# EAGLE design v0.1 (EAGLE 8.4.3)
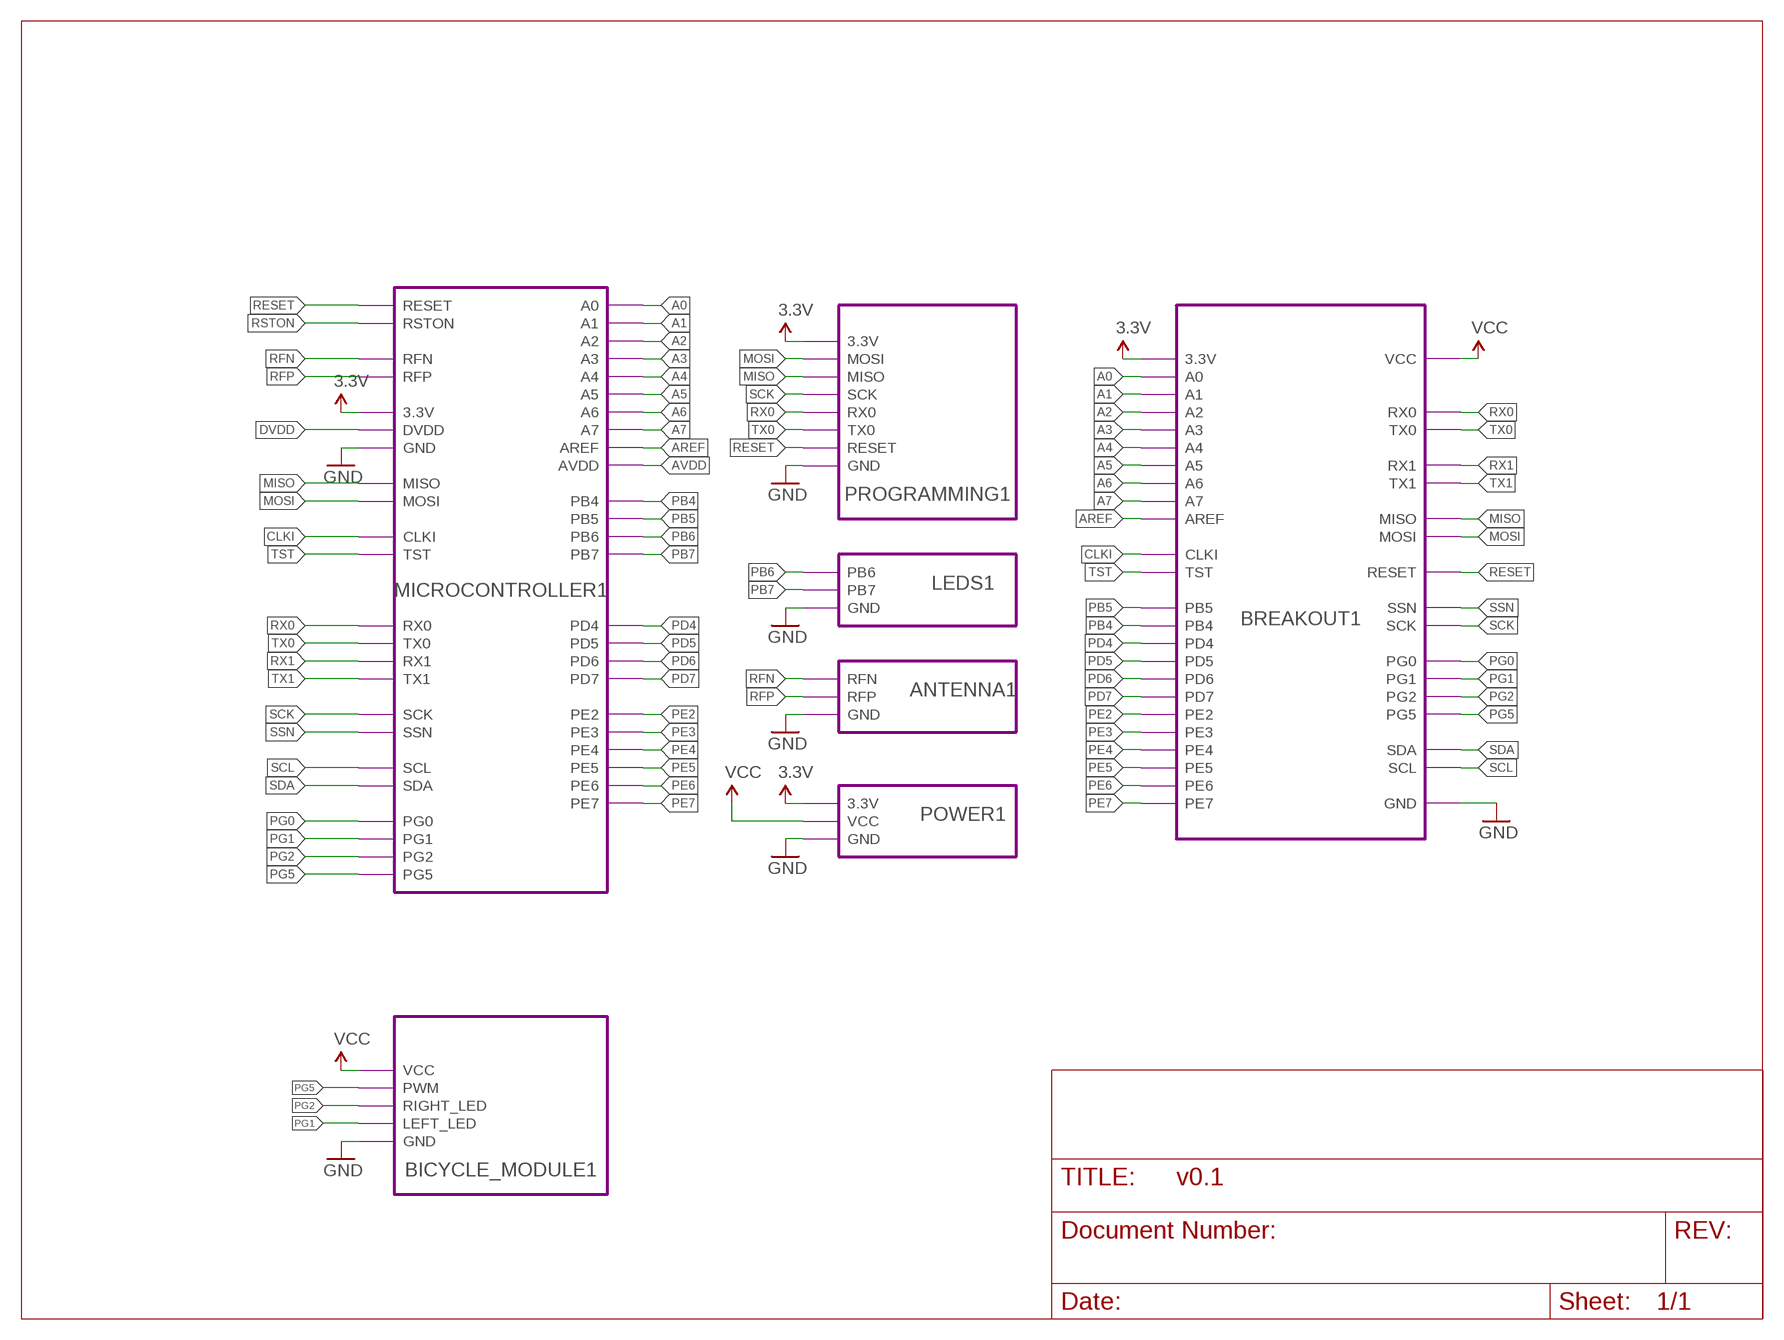
[diagram p0: schematic, sheet 1]

## Module instances
MICROCONTROLLER1 = MICROCONTROLLER
LEDS1 = LEDS
BREAKOUT1 = BREAKOUTS
ANTENNA1 = ANTENNA
POWER1 = POWER
PROGRAMMING1 = PROGRAMMING
BICYCLE_MODULE1 = BICYCLE_MODULE

## Nets
3.3V: port MICROCONTROLLER1.3.3V PROGRAMMING1.3.3V POWER1.3.3V BREAKOUT1.3.3V
A0: port MICROCONTROLLER1.A0 BREAKOUT1.A0
A1: port MICROCONTROLLER1.A1 BREAKOUT1.A1
A2: port MICROCONTROLLER1.A2 BREAKOUT1.A2
A3: port MICROCONTROLLER1.A3 BREAKOUT1.A3
A4: port MICROCONTROLLER1.A4 BREAKOUT1.A4
A5: port MICROCONTROLLER1.A5 BREAKOUT1.A5
A6: port MICROCONTROLLER1.A6 BREAKOUT1.A6
A7: port MICROCONTROLLER1.A7 BREAKOUT1.A7
AREF: port MICROCONTROLLER1.AREF BREAKOUT1.AREF
AVDD: port MICROCONTROLLER1.AVDD
CLKI: port MICROCONTROLLER1.CLKI BREAKOUT1.CLKI
DVDD: port MICROCONTROLLER1.DVDD
GND: port PROGRAMMING1.GND LEDS1.GND ANTENNA1.GND POWER1.GND MICROCONTROLLER1.GND BREAKOUT1.GND BICYCLE_MODULE1.GND
MISO: port PROGRAMMING1.MISO MICROCONTROLLER1.MISO BREAKOUT1.MISO
MOSI: port MICROCONTROLLER1.MOSI PROGRAMMING1.MOSI BREAKOUT1.MOSI
PB4: port MICROCONTROLLER1.PB4 BREAKOUT1.PB4
PB5: port MICROCONTROLLER1.PB5 BREAKOUT1.PB5
PB6: port MICROCONTROLLER1.PB6 LEDS1.PB6
PB7: port MICROCONTROLLER1.PB7 LEDS1.PB7
PD4: port MICROCONTROLLER1.PD4 BREAKOUT1.PD4
PD5: port MICROCONTROLLER1.PD5 BREAKOUT1.PD5
PD6: port MICROCONTROLLER1.PD6 BREAKOUT1.PD6
PD7: port MICROCONTROLLER1.PD7 BREAKOUT1.PD7
PE2: port MICROCONTROLLER1.PE2 BREAKOUT1.PE2
PE3: port MICROCONTROLLER1.PE3 BREAKOUT1.PE3
PE4: port MICROCONTROLLER1.PE4 BREAKOUT1.PE4
PE5: port MICROCONTROLLER1.PE5 BREAKOUT1.PE5
PE6: port MICROCONTROLLER1.PE6 BREAKOUT1.PE6
PE7: port MICROCONTROLLER1.PE7 BREAKOUT1.PE7
PG0: port MICROCONTROLLER1.PG0 BREAKOUT1.PG0
PG1: port MICROCONTROLLER1.PG1 BREAKOUT1.PG1 BICYCLE_MODULE1.LEFT_LED
PG2: port MICROCONTROLLER1.PG2 BREAKOUT1.PG2 BICYCLE_MODULE1.RIGHT_LED
PG5: port MICROCONTROLLER1.PG5 BREAKOUT1.PG5 BICYCLE_MODULE1.PWM
RESET: port MICROCONTROLLER1.RESET PROGRAMMING1.RESET BREAKOUT1.RESET
RFN: port MICROCONTROLLER1.RFN ANTENNA1.RFN
RFP: port MICROCONTROLLER1.RFP ANTENNA1.RFP
RSTON: port MICROCONTROLLER1.RSTON
RX0: port MICROCONTROLLER1.RX0 PROGRAMMING1.RX0 BREAKOUT1.RX0
RX1: port MICROCONTROLLER1.RX1 BREAKOUT1.RX1
SCK: port MICROCONTROLLER1.SCK PROGRAMMING1.SCK BREAKOUT1.SCK
SCL: port MICROCONTROLLER1.SCL BREAKOUT1.SCL
SDA: port MICROCONTROLLER1.SDA BREAKOUT1.SDA
SSN: port MICROCONTROLLER1.SSN BREAKOUT1.SSN
TST: port MICROCONTROLLER1.TST BREAKOUT1.TST
TX0: port MICROCONTROLLER1.TX0 PROGRAMMING1.TX0 BREAKOUT1.TX0
TX1: port MICROCONTROLLER1.TX1 BREAKOUT1.TX1
VCC: port BREAKOUT1.VCC POWER1.VCC BICYCLE_MODULE1.VCC

## Library data of the parts

## Module PROGRAMMING
Ports: RESET(io) SCK(io) MISO(io) MOSI(io) RX0(io) 3.3V(io) TX0(io) GND(io)
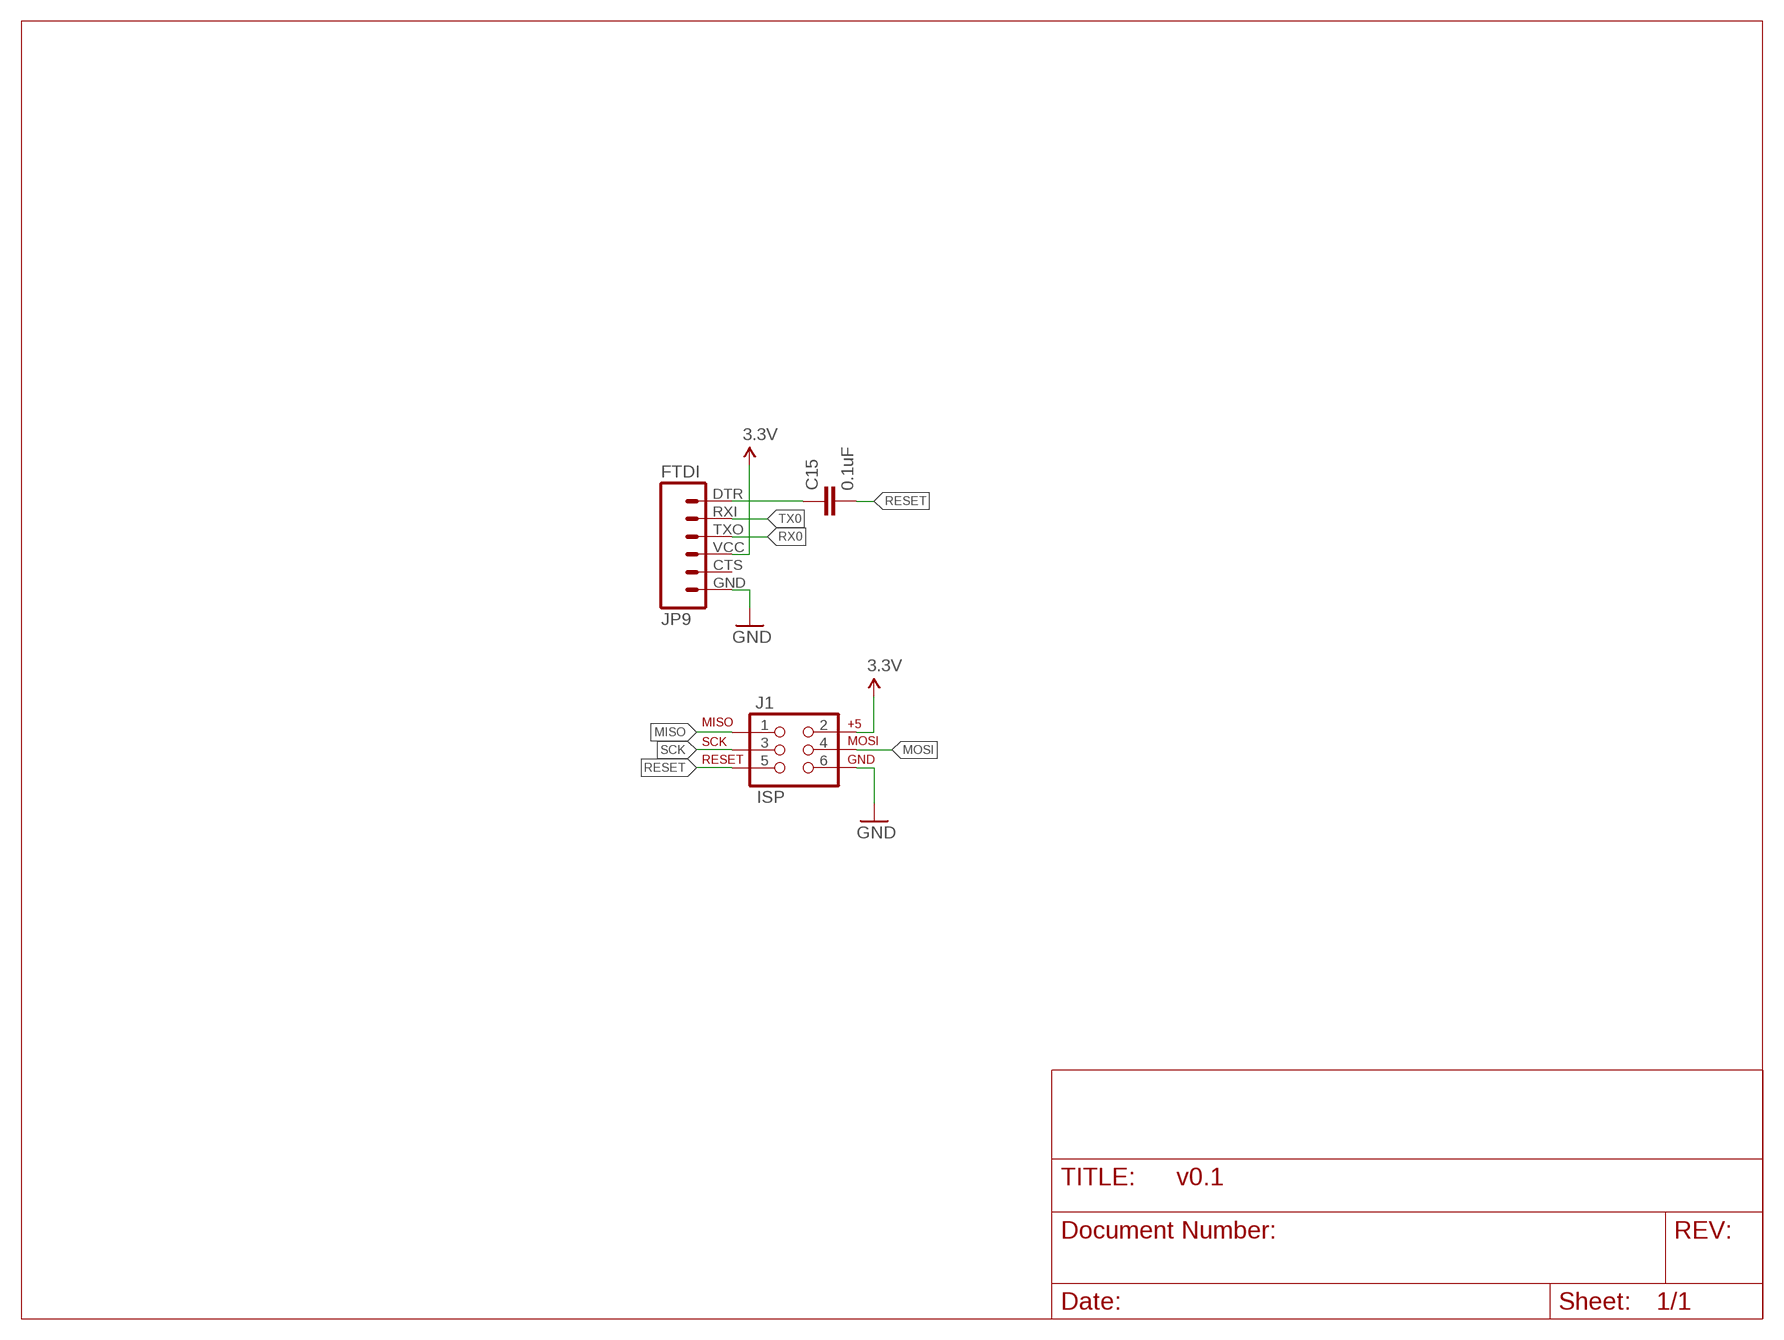
[diagram p1: schematic, module PROGRAMMING, sheet 1]

### Parts
C15  0.1uF  CAP0603-CAP  [0603-CAP]
J1  ISP  AVR_SPI_PRG_6NS  [2X3-NS]
JP9  FTDI  FTDI_BASICPTH  [FTDI_BASIC]

### Nets
3.3V: J1.2 JP9.VCC
DTR: C15.1 JP9.DTR
GND: J1.6 JP9.GND
MISO: J1.1
MOSI: J1.4
RESET: C15.2 J1.5
RX0: JP9.TXO
SCK: J1.3
TX0: JP9.RXI
Unconnected: JP9.CTS

### Library data of the parts
C15 = SparkFun-Passives:CAP: Capacitor Standard 0603 ceramic capacitor, and 0.1" leaded capacitor.
J1 = SparkFun-Connectors:AVR_SPI_PRG_6: AVR ISP 6 Pin This is the reduced ISP connector for AVR programming. Common on Arduino. This footprint will take up less PCB space and can be used with a 10-pin to 6-pin adapter such as SKU: BOB-08508
JP9 = SparkFun-Connectors:FTDI_BASIC: FTDI Basic header with labels

## Module LEDS
Ports: GND(io) PB6(io) PB7(io)
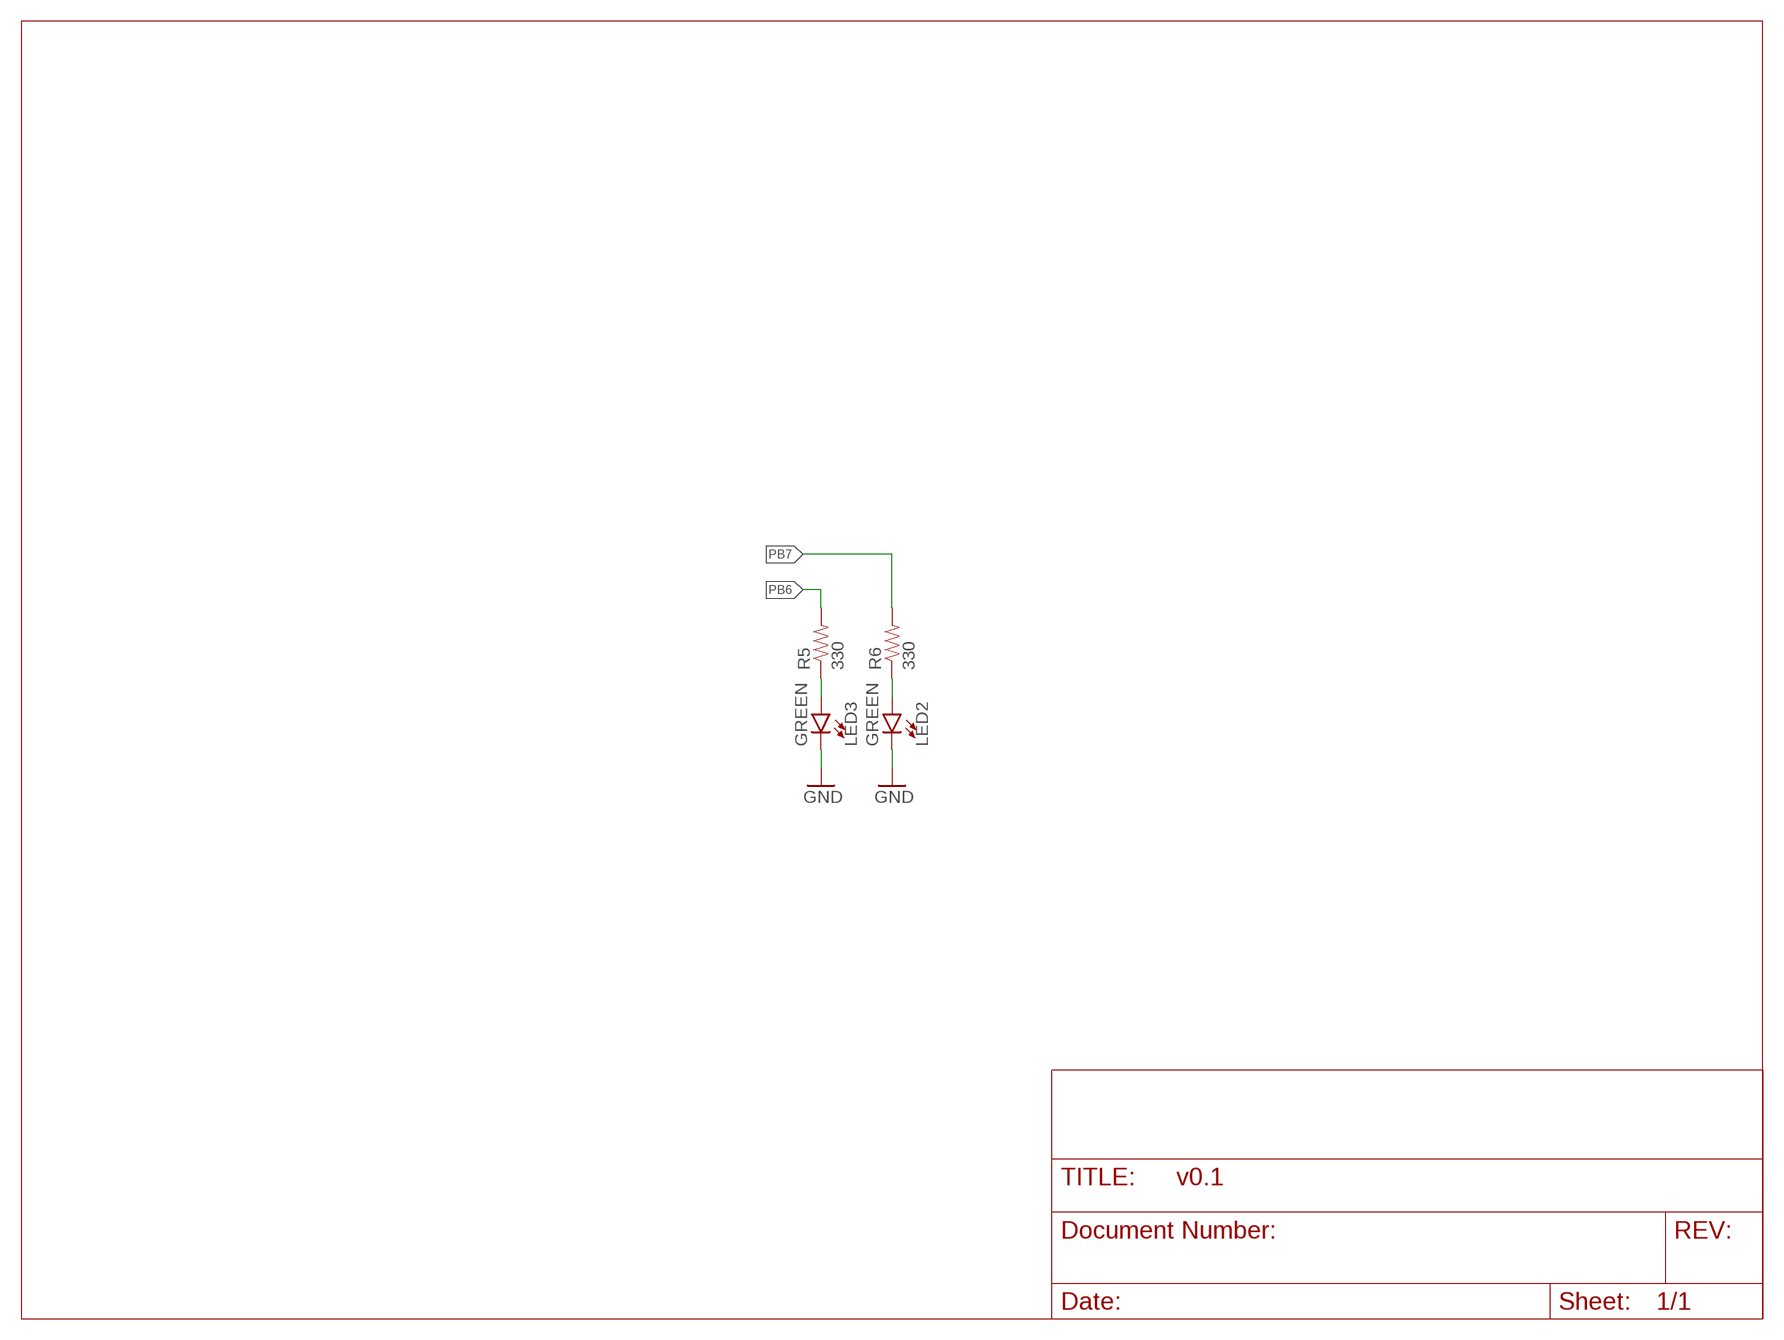
[diagram p2: schematic, module LEDS, sheet 1]

### Parts
LED2  GREEN  LED1206  [LED-1206]
LED3  GREEN  LED1206  [LED-1206]
R5  330  RESISTOR0603-RES  [0603-RES]
R6  330  RESISTOR0603-RES  [0603-RES]

### Nets
GND: LED2.C LED3.C
N$65: LED3.A R5.1
N$66: LED2.A R6.1
PB6: R5.2
PB7: R6.2

### Library data of the parts
LED2 LED3 = SparkFun-LED:LED: LED (Generic) Standard schematic elements and footprints for 5mm, 3mm, 1206, and 0603 sized LEDs. Generic LEDs with no color specified.
R5 R6 = SparkFun:RESISTOR: Resistor Basic schematic elements and footprints for 0603, 1206, and PTH resistors.

## Module POWER
Ports: 3.3V(io) GND(io) VCC(io)
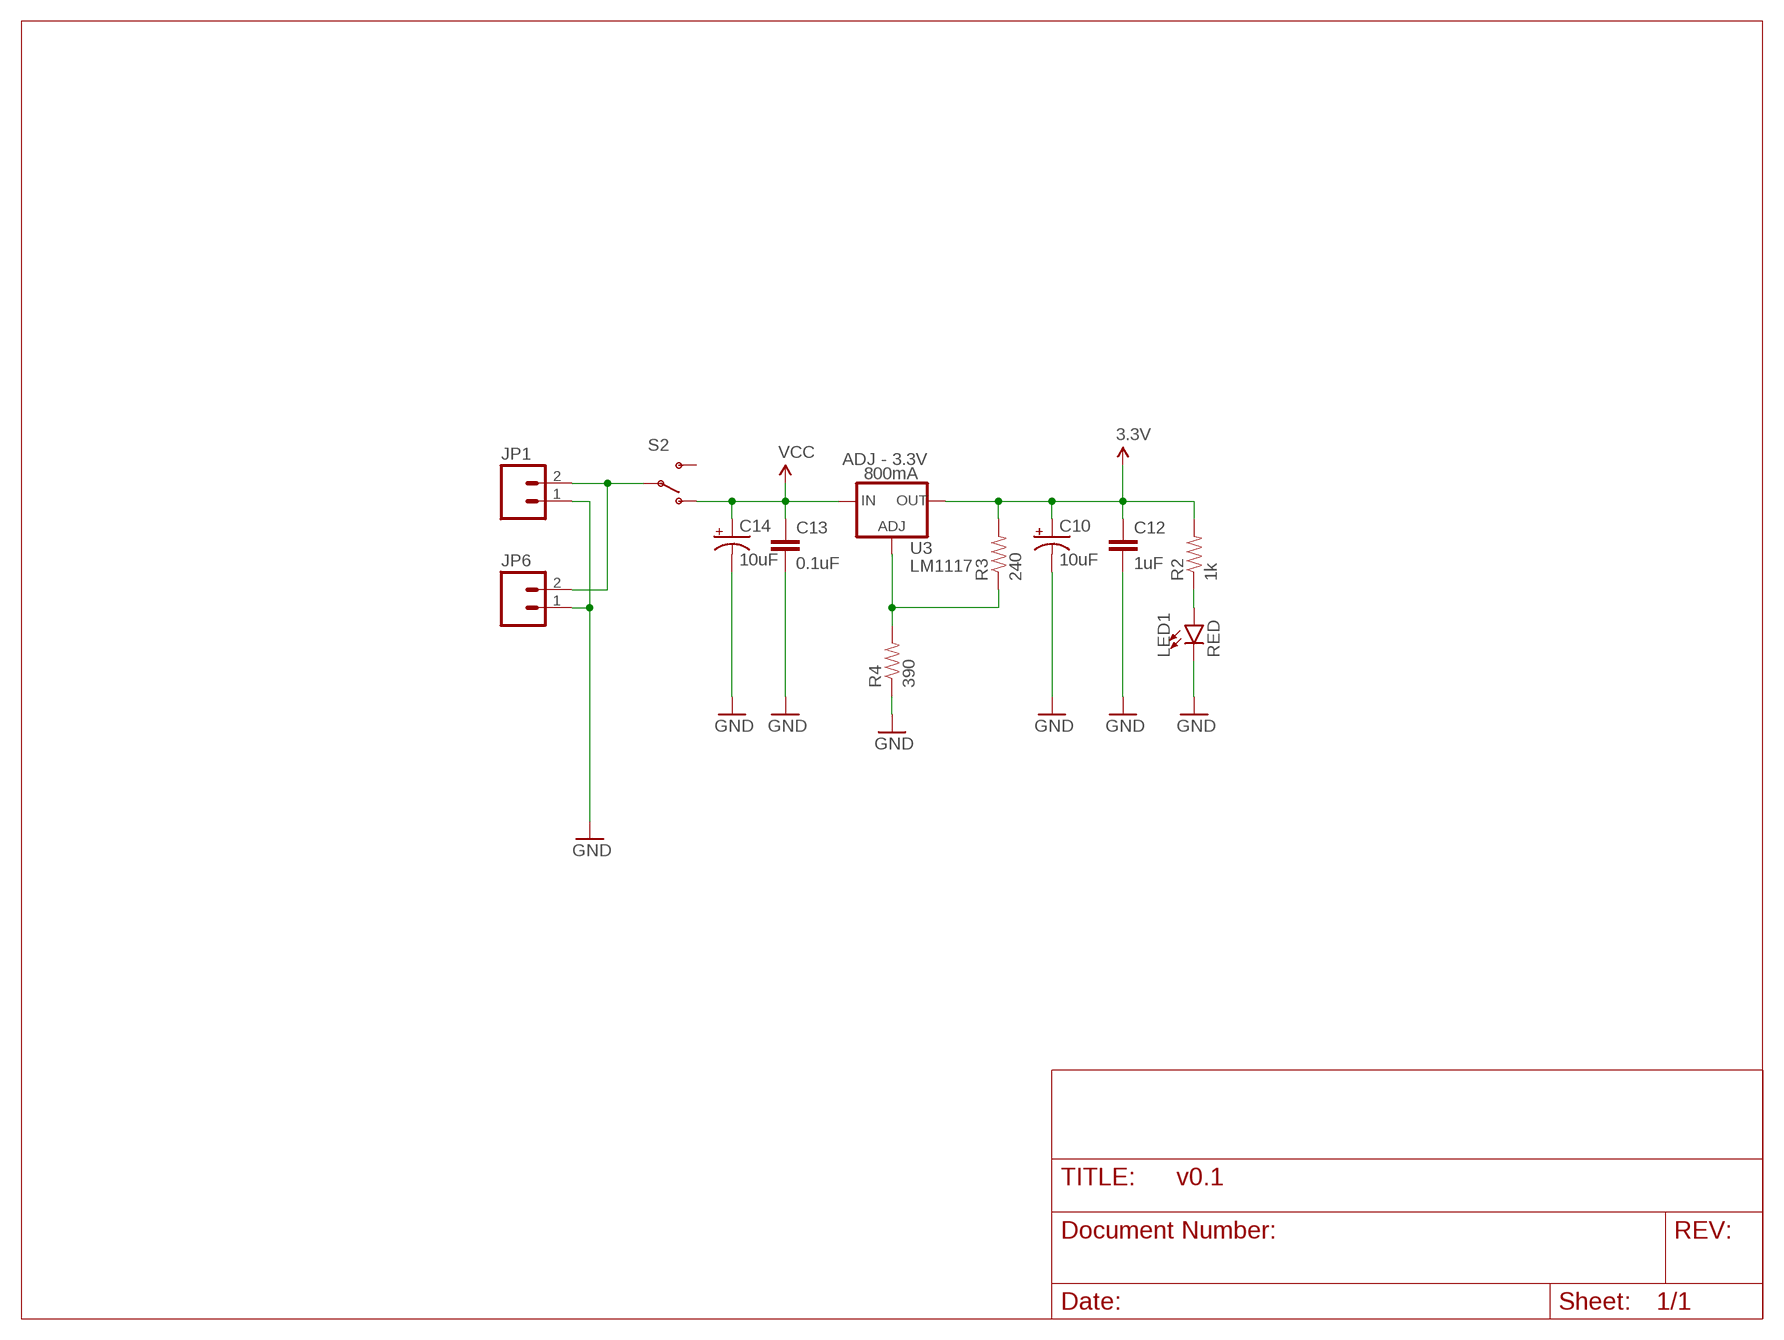
[diagram p3: schematic, module POWER, sheet 1]

### Parts
C10  10uF  CAP_POL1206  [EIA3216]
C12  1uF  CAP0603-CAP  [0603-CAP]
C13  0.1uF  CAP0603-CAP  [0603-CAP]
C14  10uF  CAP_POL1206  [EIA3216]
JP1  M021X02_NO_SILK  [1X02_NO_SILK]
JP6  M02JST-PTH-2  [JST-2-PTH]
LED1  RED  LED1206  [LED-1206]
R2  1k  RESISTOR0603-RES  [0603-RES]
R3  240  RESISTOR0603-RES  [0603-RES]
R4  390  RESISTOR0603-RES  [0603-RES]
S2  SWITCH-SPST-SMD-A  [SWITCH-SPST-SMD-A]
U3  LM1117  V_REG_317SMD  [SOT223]

### Nets
3.3V: C10.A(+) C12.1 R2.2 R3.2 U3.2(OUT)
FB: R3.1 R4.2 U3.1(ADJ)
GND: C10.C(-) C12.2 C13.2 C14.C(-) JP1.1 JP6.1 LED1.C R4.1
N$61: LED1.A R2.1
N$67: JP1.2 JP6.2 S2.2(P)
VCC: C13.1 C14.A(+) S2.1(O) U3.3(IN)
Unconnected: S2.3(S)

### Notes on the sheet
- ADJ - 3.3V
- 800mA

### Library data of the parts
C10 C14 = SparkFun-Passives:CAP_POL: Capacitor Polarized These are standard SMD and PTH capacitors. Normally 10uF, 47uF, and 100uF in electrolytic and tantalum varieties. Always verify the external diameter of the through hole cap, it varies with capacity, voltage, and manufacturer. The EIA devices should be standard.
C12 C13 = SparkFun-Passives:CAP: Capacitor Standard 0603 ceramic capacitor, and 0.1" leaded capacitor.
JP1 JP6 = SparkFun-Connectors:M02: Header 2 Standard 2-pin 0.1" header. Use with straight break away headers (SKU : PRT-00116), right angle break away headers (PRT-00553), swiss pins (PRT-00743), machine pins (PRT-00117), and female headers (PRT-00115). Molex polarized connector foot print use with SKU : PRT-08233 with associated crimp pins and housings.
LED1 = SparkFun-LED:LED: LED (Generic) Standard schematic elements and footprints for 5mm, 3mm, 1206, and 0603 sized LEDs. Generic LEDs with no color specified.
R2 = SparkFun-Passives:RESISTOR: Resistor Basic schematic elements and footprints for 0603, 1206, and PTH resistors.
R3 R4 = SparkFun:RESISTOR: Resistor Basic schematic elements and footprints for 0603, 1206, and PTH resistors.
S2 = SparkFun:SWITCH-SPST: SPST Switch Simple slide switch. Spark Fun Electronics SKU : COM-00102
U3 = SparkFun:V_REG_317: Voltage Regulator Standard LM317 adjustable voltage regulator. AOI (Adjust Output Input). Google 'LM317 Calculator' for easy to use app to get the two resistor values needed. 240/720 for 5V output. 240/390 for 3.3V output. Spark Fun Electronics SKU : COM-00527

## Module ANTENNA
Ports: GND(io) RFN(io) RFP(io)
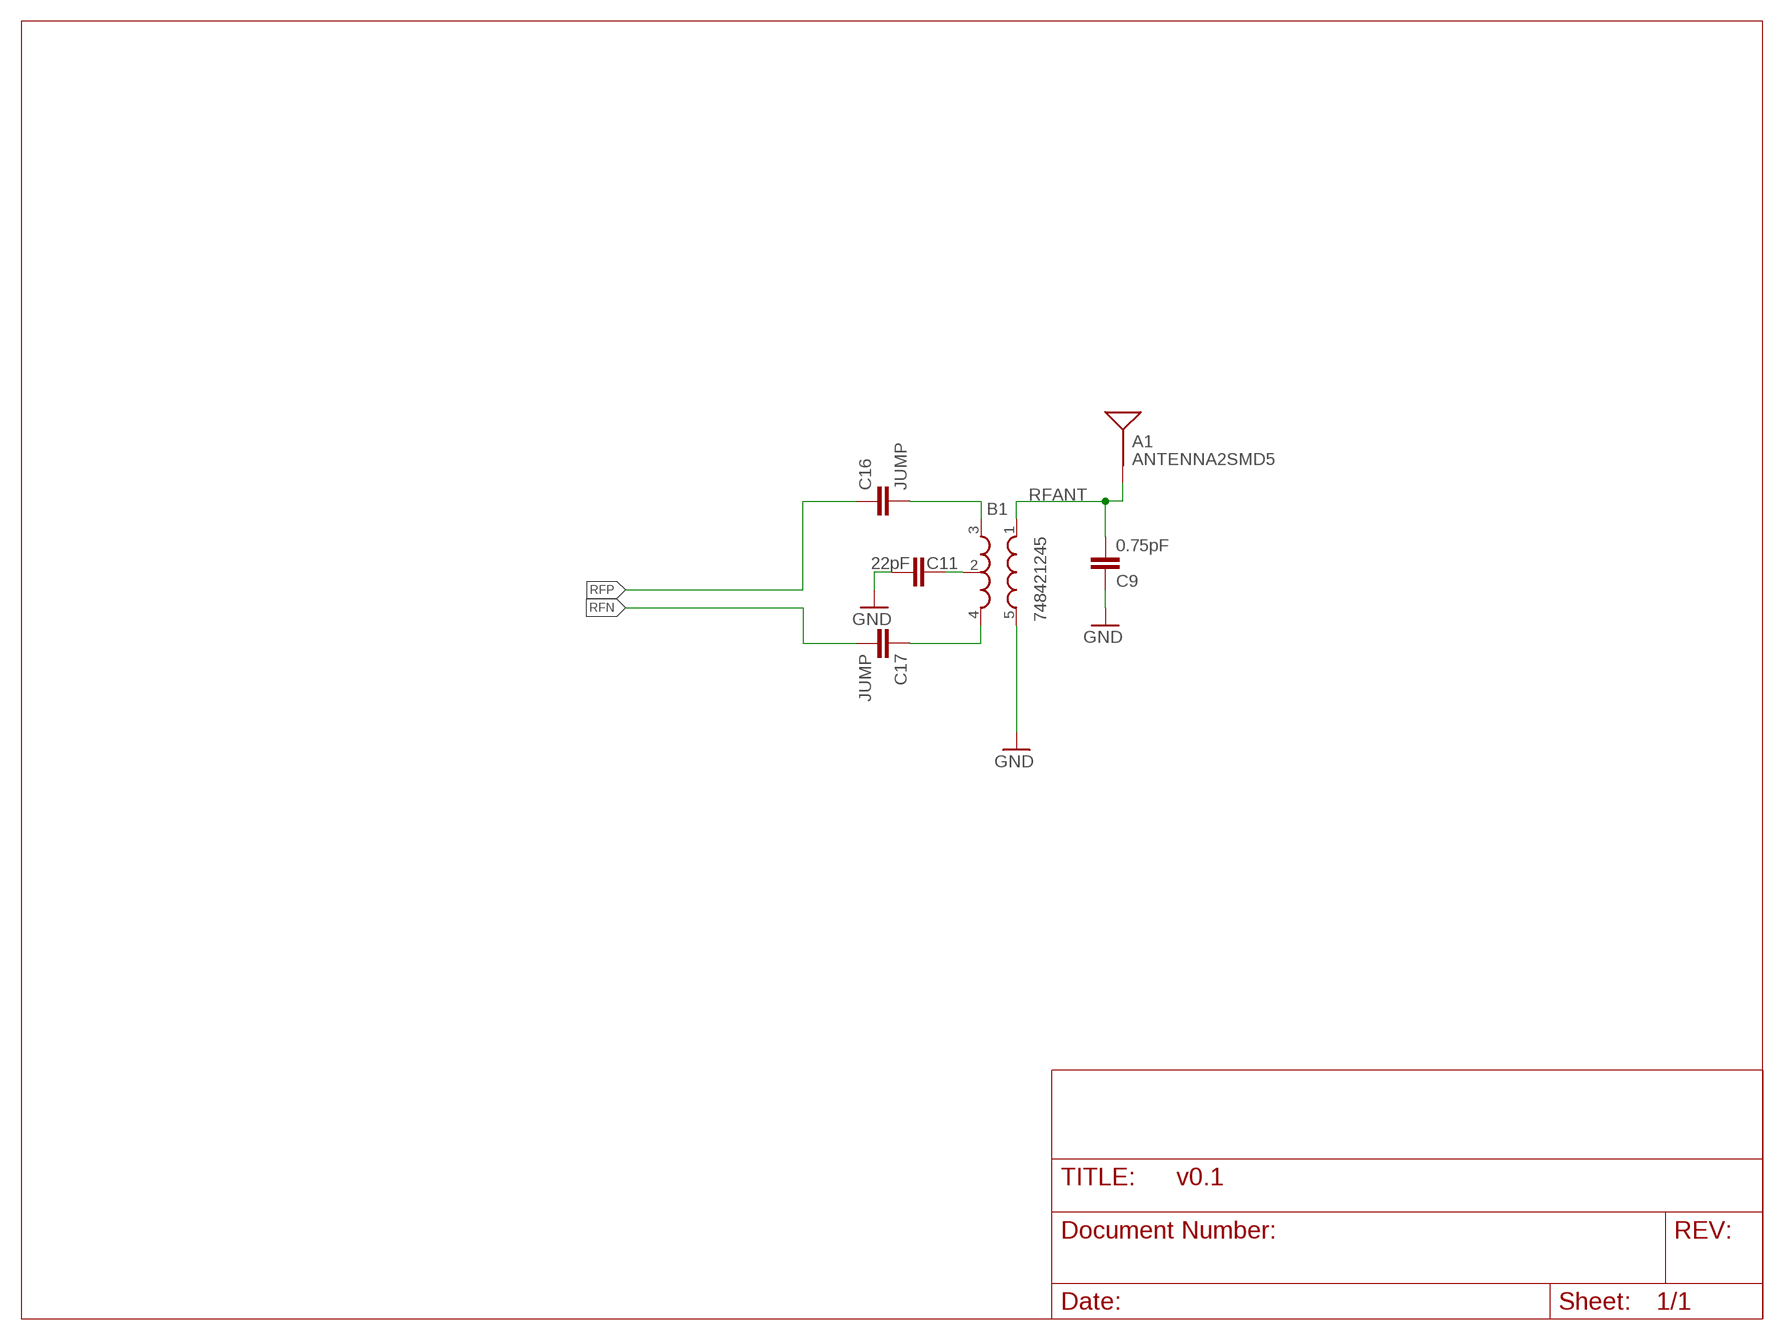
[diagram p4: schematic, module ANTENNA, sheet 1]

### Parts
A1  ANTENNA2SMD5  [ANTENNA-CHIP5]
B1  748421245  BALUN0805  [BALUN-0805]
C9  0.75pF  CAP0603-CAP  [0603-CAP]
C11  22pF  CAP0603-CAP  [0603-CAP]
C16  JUMP  CAP0603-CAP  [0603-CAP]
C17  JUMP  CAP0603-CAP  [0603-CAP]

### Nets
GND: B1.5(GND) C9.1 C11.2
N$62: B1.2(GND) C11.1
N$63: B1.3(OUT1) C16.2
N$64: B1.4(OUT2) C17.1
RFANT: A1.FEED(SIGNAL) B1.1(IN) C9.2
RFN: C17.2
RFP: C16.1

### Library data of the parts
A1 = SparkFun-RF:ANTENNA2: Chip antenna Single endded antenna. Common with smaller chip antennas. CHIP4 package is the GPS Chip Antenna SKU: GPS-08418. CHIP5 package is 2.4GHz chip antenna SKU: WRL-00144.
B1 = SparkFun-RF:BALUN: Balun Transformer to convert an unbalanced signal to a balenced one, or vice-versa. Example Datasheet <http://katalog.we-online.de/pbs/datasheet/748421245.pdf>; PROD_ID: COMP-09637
C9 C11 = SparkFun-Passives:CAP: Capacitor Standard 0603 ceramic capacitor, and 0.1" leaded capacitor.
C16 C17 = SparkFun:CAP: Capacitor Standard 0603 ceramic capacitor, and 0.1" leaded capacitor.

## Module MICROCONTROLLER
Ports: A0(io) A1(io) A2(io) A3(io) A4(io) A5(io) A6(io) A7(io) AREF(io) AVDD(io) PB4(io) PB5(io) PB6(io) PB7(io) PD4(io) PD5(io) PD6(io) PD7(io) PE2(io) PE3(io) PE4(io) PE5(io) PE6(io) PE7(io) PG0(io) PG1(io) PG2(io) PG5(io) RESET(io) RFN(io) RFP(io) DVDD(io) GND(io) 3.3V(io) MISO(io) MOSI(io) CLKI(io) TST(io) RX0(io) TX0(io) RX1(io) TX1(io) SCK(io) SSN(io) RSTON(io) SCL(io) SDA(io)
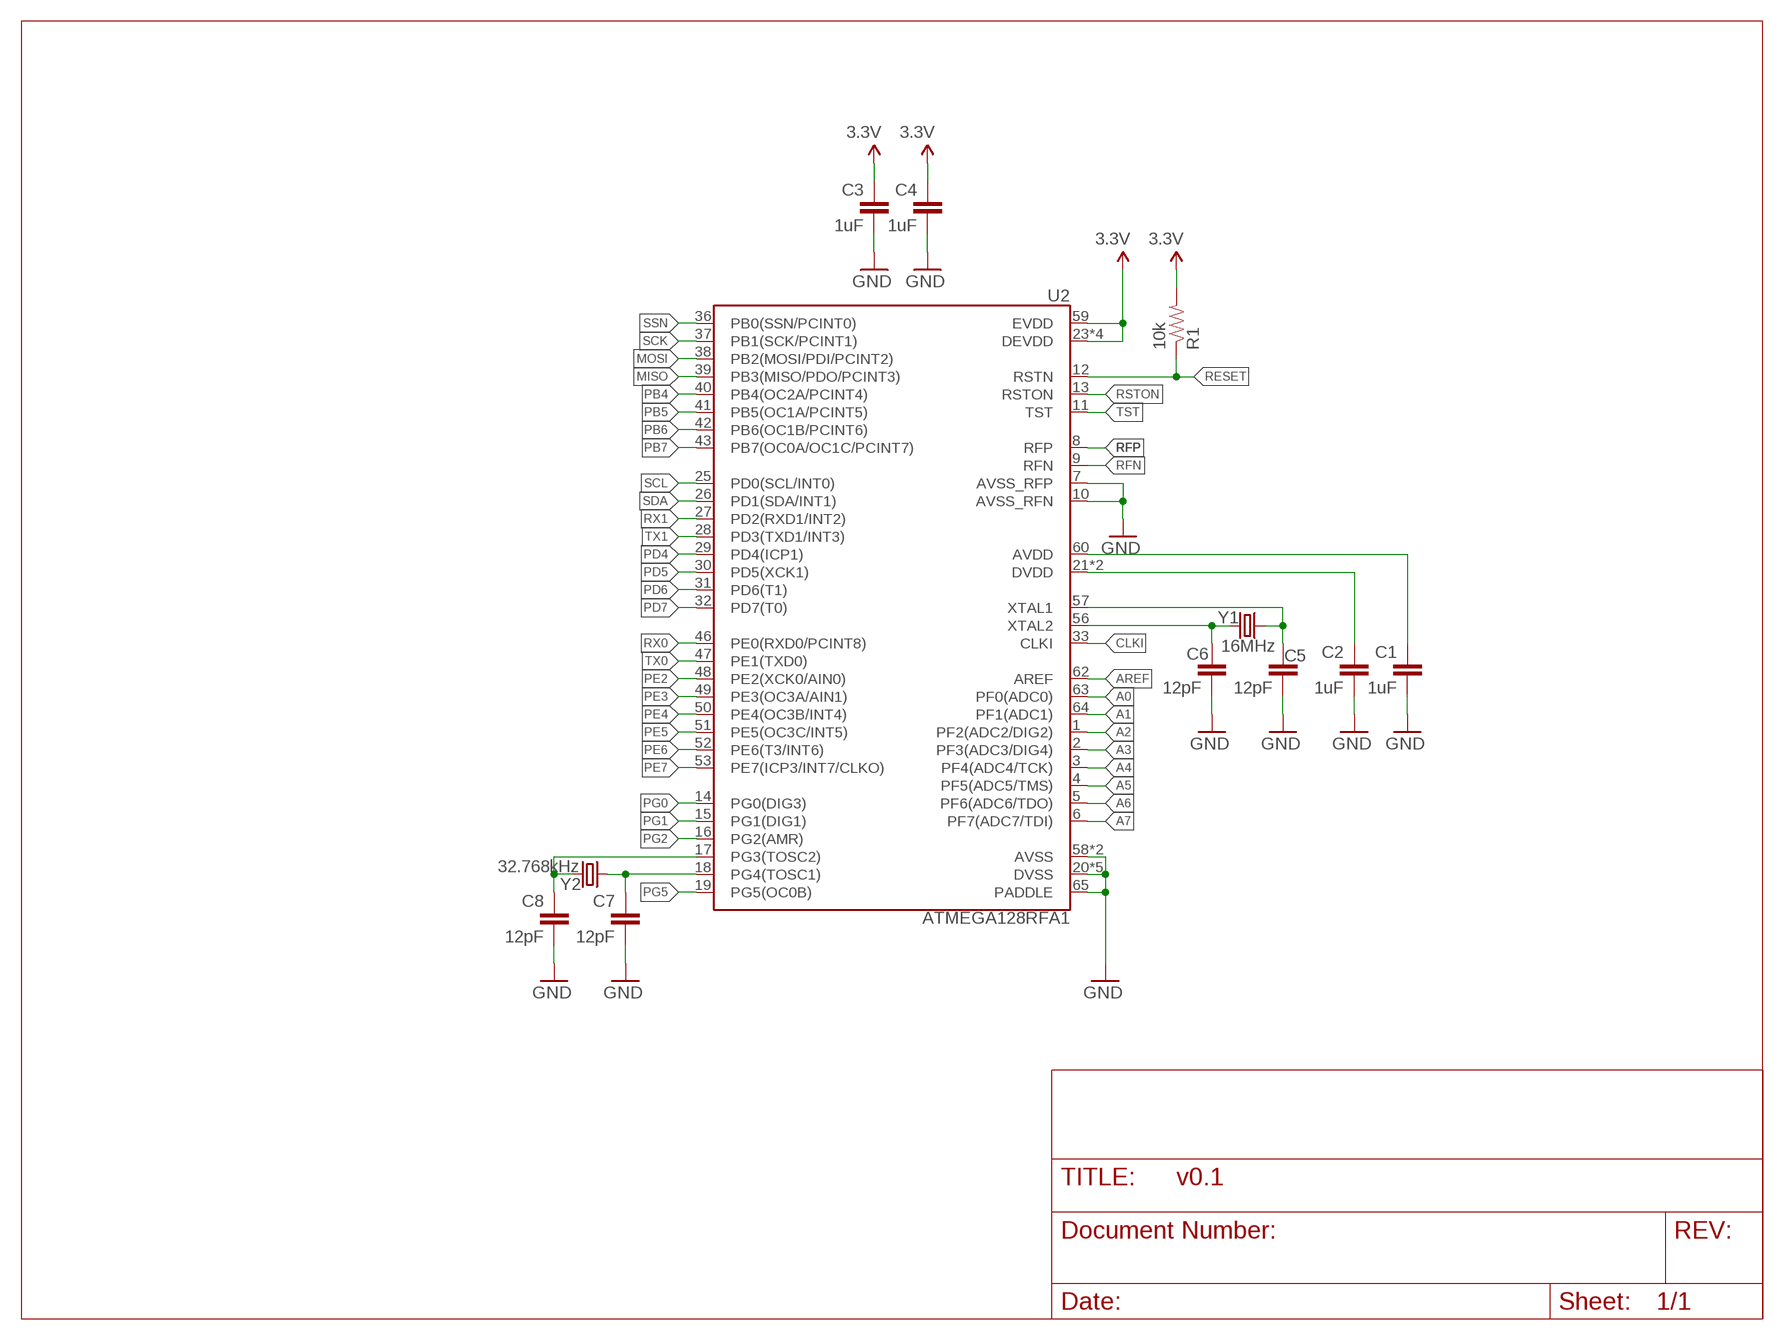
[diagram p5: schematic, module MICROCONTROLLER, sheet 1]

### Parts
C1  1uF  CAP0603-CAP  [0603-CAP]
C2  1uF  CAP0603-CAP  [0603-CAP]
C3  1uF  CAP0603-CAP  [0603-CAP]
C4  1uF  CAP0603-CAP  [0603-CAP]
C5  12pF  CAP0603-CAP  [0603-CAP]
C6  12pF  CAP0603-CAP  [0603-CAP]
C7  12pF  CAP0603-CAP  [0603-CAP]
C8  12pF  CAP0603-CAP  [0603-CAP]
R1  10k  RESISTOR0603-RES  [0603-RES]
U2  ATMEGA128RFA1  [QFN-64]
Y1  16MHz  CRYSTAL5X3  [CRYSTAL-SMD-5X3]
Y2  32.768kHz  CRYSTAL32-SMD  [CRYSTAL-32KHZ-SMD]

### Nets
3.3V: C3.1 C4.1 R1.2 U2.23(DEVDD) U2.34(DEVDD) U2.44(DEVDD) U2.54(DEVDD) U2.59(EVDD)
A0: U2.63(PF0(ADC0))
A1: U2.64(PF1(ADC1))
A2: U2.1(PF2(ADC2/DIG2))
A3: U2.2(PF3(ADC3/DIG4))
A4: U2.3(PF4(ADC4/TCK))
A5: U2.4(PF5(ADC5/TMS))
A6: U2.5(PF6(ADC6/TDO))
A7: U2.6(PF7(ADC7/TDI))
AREF: U2.62(AREF)
AVDD: C1.1 U2.60(AVDD)
CLKI: U2.33(CLKI)
DVDD: C2.1 U2.21(DVDD) U2.22(DVDD)
GND: C1.2 C2.2 C3.2 C4.2 C5.2 C6.2 C7.2 C8.2 U2.7(AVSS_RFP) U2.10(AVSS_RFN) U2.20(DVSS) U2.24(DVSS) U2.35(DVSS) U2.45(DVSS) U2.55(DVSS) U2.58(AVSS) U2.61(AVSS) U2.65(PADDLE)
MISO: U2.39(PB3(MISO/PDO/PCINT3))
MOSI: U2.38(PB2(MOSI/PDI/PCINT2))
N$57: C5.1 U2.57(XTAL1) Y1.3
N$58: C6.1 U2.56(XTAL2) Y1.1
N$59: C7.1 U2.18(PG4(TOSC1)) Y2.X1
N$60: C8.1 U2.17(PG3(TOSC2)) Y2.X2
PB4: U2.40(PB4(OC2A/PCINT4))
PB5: U2.41(PB5(OC1A/PCINT5))
PB6: U2.42(PB6(OC1B/PCINT6))
PB7: U2.43(PB7(OC0A/OC1C/PCINT7))
PD4: U2.29(PD4(ICP1))
PD5: U2.30(PD5(XCK1))
PD6: U2.31(PD6(T1))
PD7: U2.32(PD7(T0))
PE2: U2.48(PE2(XCK0/AIN0))
PE3: U2.49(PE3(OC3A/AIN1))
PE4: U2.50(PE4(OC3B/INT4))
PE5: U2.51(PE5(OC3C/INT5))
PE6: U2.52(PE6(T3/INT6))
PE7: U2.53(PE7(ICP3/INT7/CLKO))
PG0: U2.14(PG0(DIG3))
PG1: U2.15(PG1(DIG1))
PG2: U2.16(PG2(AMR))
PG5: U2.19(PG5(OC0B))
RESET: R1.1 U2.12(RSTN)
RFN: U2.9(RFN)
RFP: U2.8(RFP)
RSTON: U2.13(RSTON)
RX0: U2.46(PE0(RXD0/PCINT8))
RX1: U2.27(PD2(RXD1/INT2))
SCK: U2.37(PB1(SCK/PCINT1))
SCL: U2.25(PD0(SCL/INT0))
SDA: U2.26(PD1(SDA/INT1))
SSN: U2.36(PB0(SSN/PCINT0))
TST: U2.11(TST)
TX0: U2.47(PE1(TXD0))
TX1: U2.28(PD3(TXD1/INT3))

### Library data of the parts
C1-C8 = SparkFun-Passives:CAP: Capacitor Standard 0603 ceramic capacitor, and 0.1" leaded capacitor.
R1 = SparkFun-Passives:RESISTOR: Resistor Basic schematic elements and footprints for 0603, 1206, and PTH resistors.
U2 = SparkFun-DigitalIC:ATMEGA128RFA1: ATmega128RFA1 8-bit AVR Microcontroller with Low Power 2.4GHz Transceiver for ZigBee and IEEE 802.15.4
Y1 Y2 = SparkFun-FreqCtrl:CRYSTAL: Various standard crystals. Proven footprints. Spark Fun Electronics SKU : COM-00534

## Module BREAKOUTS
Ports: 3.3V(io) A0(io) A1(io) A2(io) A3(io) A4(io) A5(io) A6(io) A7(io) AREF(io) CLKI(io) GND(io) MISO(io) MOSI(io) PB4(io) PB5(io) PD4(io) PD5(io) PD6(io) PD7(io) PE2(io) PE3(io) PE4(io) PE5(io) PE6(io) PE7(io) PG0(io) PG1(io) PG2(io) PG5(io) RESET(io) RX0(io) RX1(io) SCK(io) SCL(io) SDA(io) SSN(io) TST(io) TX0(io) TX1(io) VCC(io)
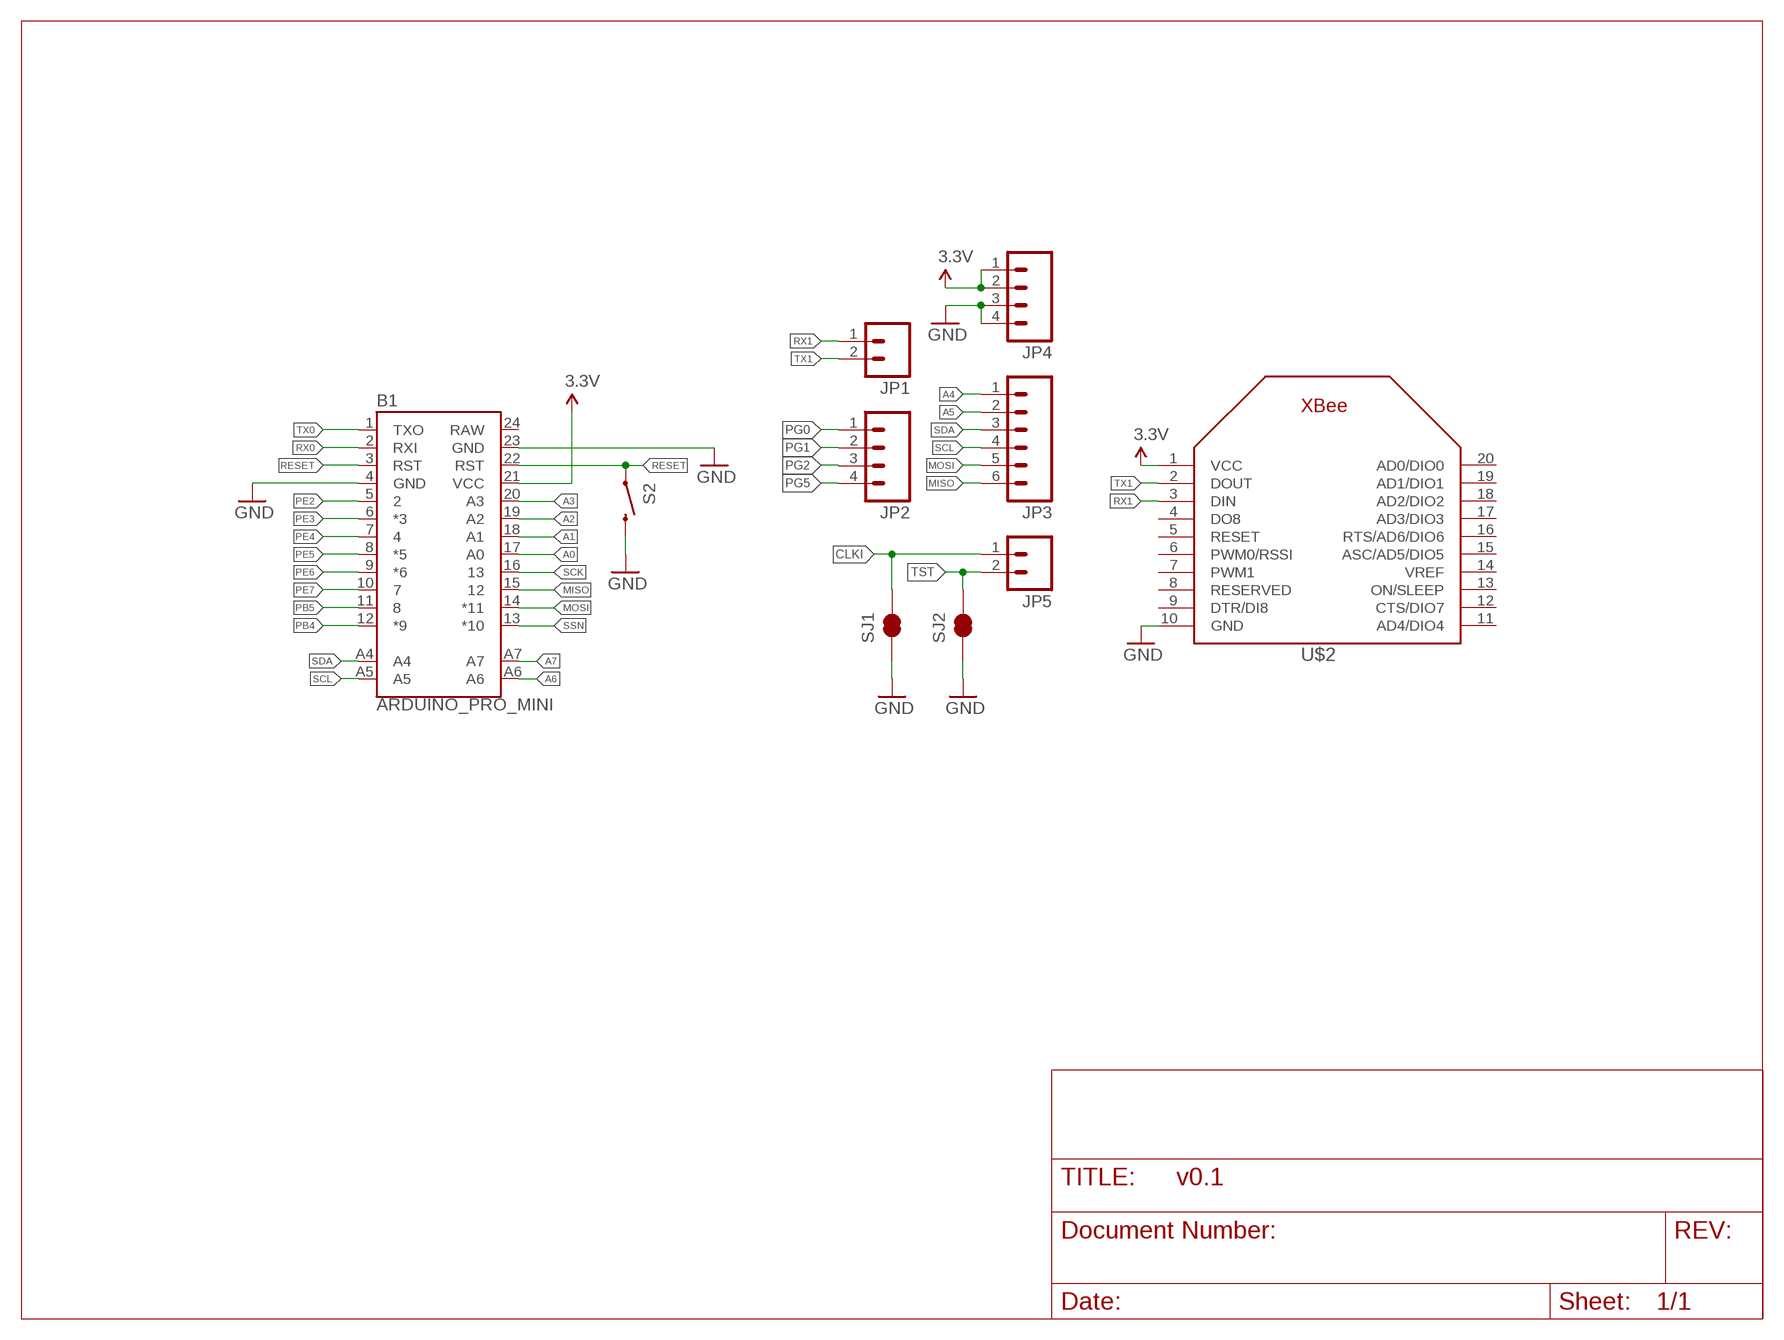
[diagram p6: schematic, module BREAKOUTS, sheet 1]

### Parts
B1  ARDUINO_PRO_MINI  [ARDUINO_PRO_MINI]
JP1  M021X02_NO_SILK  [1X02_NO_SILK]
JP2  M041X04_NO_SILK  [1X04_NO_SILK]
JP3  M06SIP-NS  [1X06_NS]
JP4  M041X04_NO_SILK  [1X04_NO_SILK]
JP5  M021X02_NO_SILK  [1X02_NO_SILK]
S2  SWITCH-MOMENTARY-2SMD  [TACTILE_SWITCH_SMD]
SJ1  SOLDERJUMPERTRACE  [SJ_2S-TRACE]
SJ2  SOLDERJUMPERTRACE  [SJ_2S-TRACE]
U$2  XBEE  [XBEE]

### Nets
3.3V: B1.21(VCC) JP4.1 JP4.2 U$2.1(VCC)
A0: B1.17(A0)
A1: B1.18(A1)
A2: B1.19(A2)
A3: B1.20(A3)
A4: JP3.1
A5: JP3.2
A6: B1.A6
A7: B1.A7
CLKI: JP5.1 SJ1.2
GND: B1.4(GND) B1.23(GND) JP4.3 JP4.4 S2.3 SJ1.1 SJ2.1 U$2.10(GND)
MISO: B1.15 JP3.6
MOSI: B1.14(*11) JP3.5
PB4: B1.12(*9)
PB5: B1.11
PE2: B1.5
PE3: B1.6(*3)
PE4: B1.7
PE5: B1.8(*5)
PE6: B1.9(*6)
PE7: B1.10
PG0: JP2.1
PG1: JP2.2
PG2: JP2.3
PG5: JP2.4
RESET: B1.3(RST) B1.22(RST) S2.1
RX0: B1.2(RXI)
RX1: JP1.1 U$2.3(DIN)
SCK: B1.16
SCL: B1.A5 JP3.4
SDA: B1.A4 JP3.3
SSN: B1.13(*10)
TST: JP5.2 SJ2.2
TX0: B1.1(TXO)
TX1: JP1.2 U$2.2(DOUT)
Unconnected: U$2.4(DO8) U$2.5(RESET) U$2.6(PWM0/RSSI) U$2.7(PWM1) U$2.8(RESERVED) U$2.9(DTR/DI8) U$2.11(AD4/DIO4) U$2.12(CTS/DIO7) U$2.13(ON/SLEEP) U$2.14(VREF) U$2.15(ASC/AD5/DIO5) U$2.16(RTS/AD6/DIO6) U$2.17(AD3/DIO3) U$2.18(AD2/DIO2) U$2.19(AD1/DIO1) U$2.20(AD0/DIO0)

### Power pins joined to a net without a drawn wire
RAW: B1.24(RAW)

### Library data of the parts
B1 = SparkFun-Boards:ARDUINO_PRO_MINI: SparkFun Pro Mini Pro Mini compatible footprint. Dimensions: 0.7 x 1.3" PCB Thickness: 0.8mm SparkFun Products: 3.3V/8MHz <https://www.sparkfun.com/products/11114> 5V/16MHz <https://www.sparkfun.com/products/11113>
JP1 JP5 = SparkFun-Connectors:M02: Header 2 Standard 2-pin 0.1" header. Use with straight break away headers (SKU : PRT-00116), right angle break away headers (PRT-00553), swiss pins (PRT-00743), machine pins (PRT-00117), and female headers (PRT-00115). Molex polarized connector foot print use with SKU : PRT-08233 with associated crimp pins and housings.
JP2 JP4 = SparkFun-Connectors:M04: Header 4 Standard 4-pin 0.1" header. Use with straight break away headers (SKU : PRT-00116), right angle break away headers (PRT-00553), swiss pins (PRT-00743), machine pins (PRT-00117), and female headers (PRT-00115). Molex polarized connector foot print use with SKU : PRT-08231 with associated crimp pins and housings. 1MM SMD Version SKU: PRT-10208
JP3 = SparkFun-Connectors:M06: Header 6 Standard 6-pin 0.1" header. Use with straight break away headers (SKU : PRT-00116), right angle break away headers (PRT-00553), swiss pins (PRT-00743), machine pins (PRT-00117), and female headers (PRT-00115). Molex polarized connector foot print use with SKU : PRT-08094 with associated crimp pins and housings. NOTES ON THE VARIANTS LOCK and LOCK_LONGPADS... This footprint was designed to help hold the alignment of a through-hole component (i.e. 6-pin header) while soldering it into place. You may notice that each hole has been shifted either up or down by 0.005 of an inch from it's more standard position (which is a perfectly straight line). This slight alteration caused the pins (the squares in the middle) to touch the edges of the holes. Because they are alternating, it causes a "brace" to hold the component in place. 0.005 has proven to be the perfect amount of "off-center" position when using our standard breakaway headers. Although looks a little odd when you look at the bare footprint, once you have a header in there, the alteration is very hard to notice. Also, if you push a header all the way into place, it is covered up entirely on the bottom side. This idea of altering the position of holes to aid alignment will be further integrated into the Sparkfun Library for other footprints. It can help hold any component with 3 or more connection pins.
S2 = SparkFun-Electromechanical:SWITCH-MOMENTARY-2: Various NO switches- pushbuttons, reed, etc
SJ1 SJ2 = SparkFun-Passives:SOLDERJUMPER: Solder Jumper Standard SMD solder jumper. Used to automate production. Two varients : Normally Open and Normally Closed are the same, but have different paste layers. NC will have a large amount of paste and should jumper during reflow.
U$2 = adafruit:XBEE

## Module BICYCLE_MODULE
Ports: VCC(io) PWM(io) GND(io) RIGHT_LED(io) LEFT_LED(io)
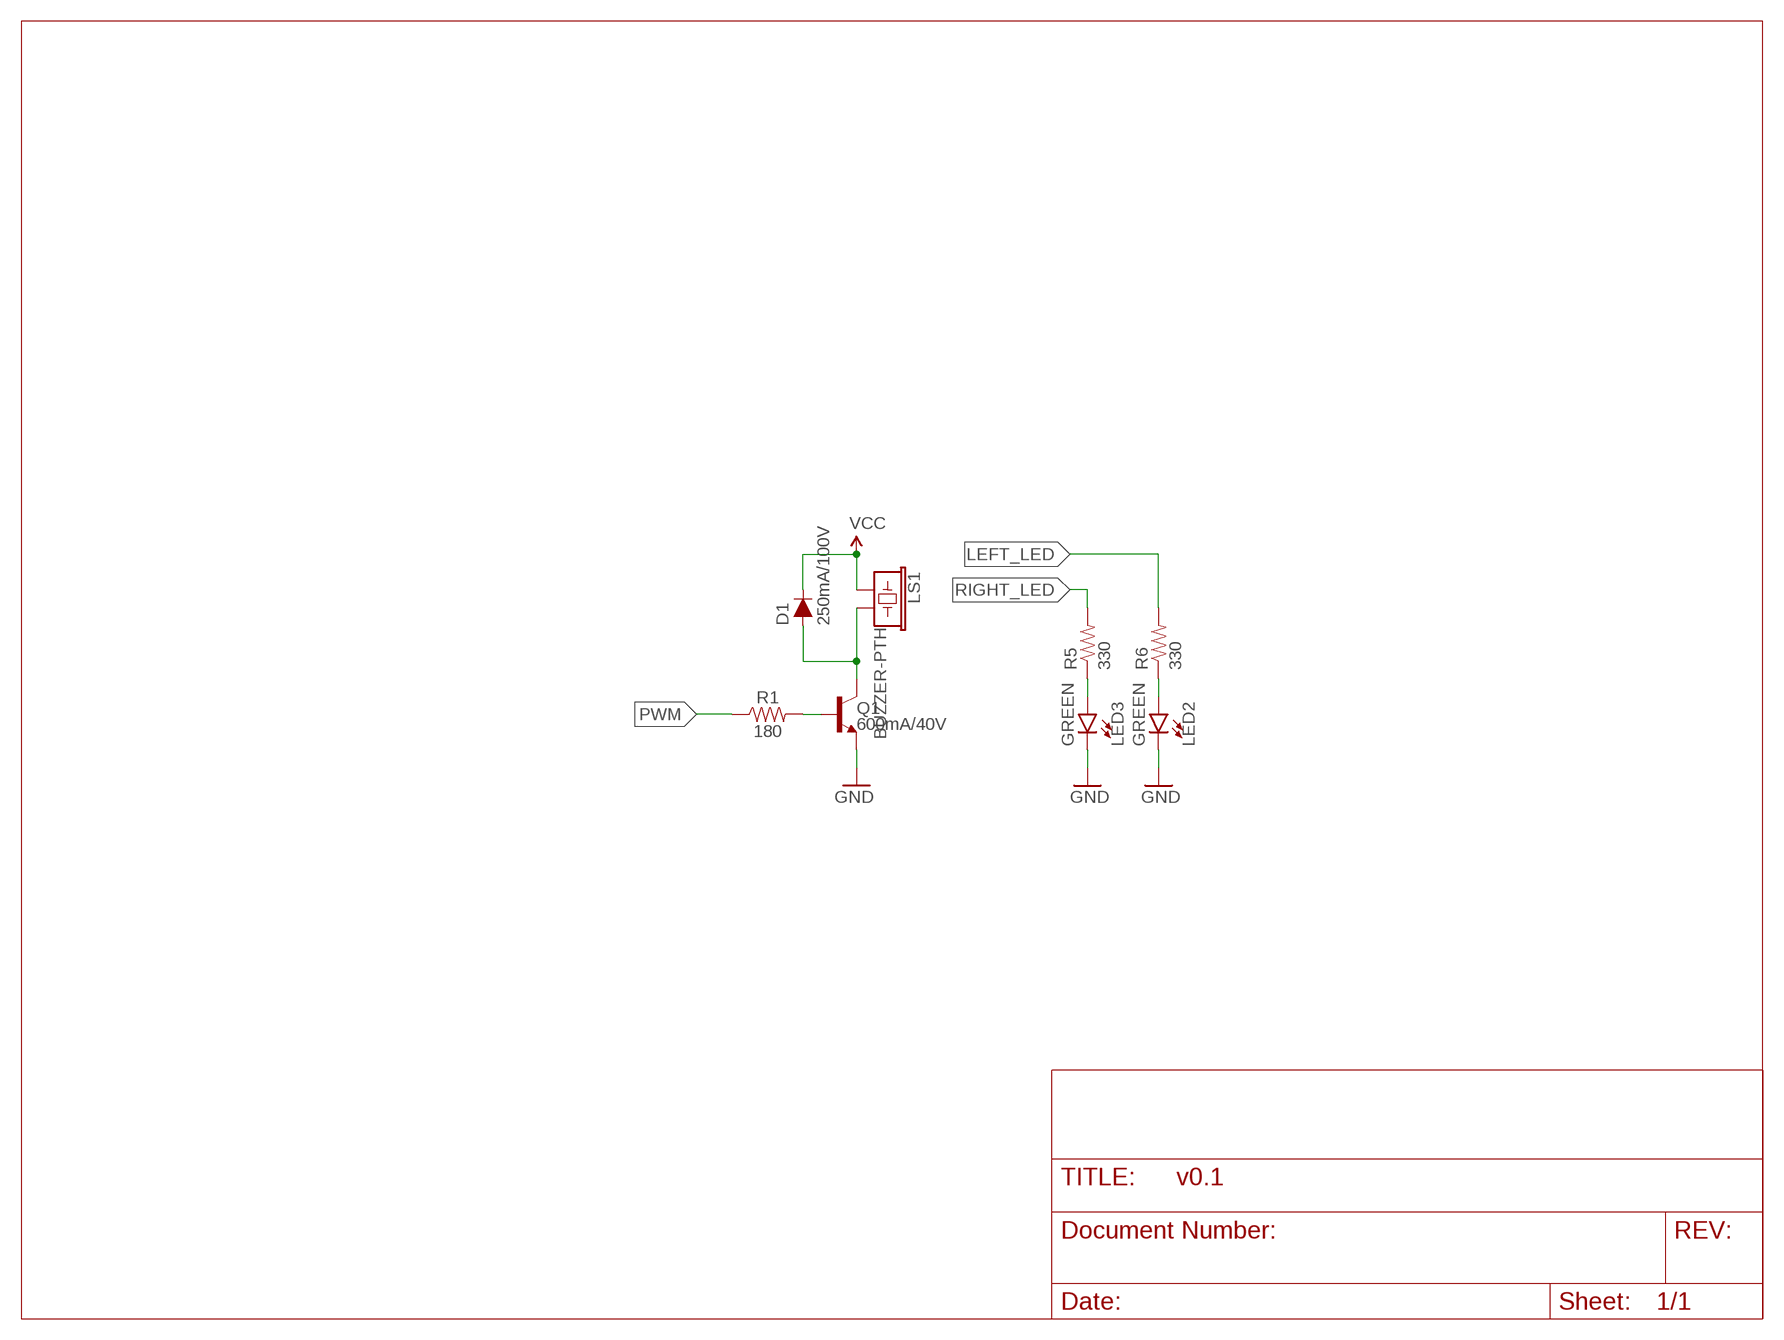
[diagram p7: schematic, module BICYCLE_MODULE, sheet 1]

### Parts
D1  250mA/100V  DIODE-BAS16J  [SOD-323]
LED2  GREEN  LED1206  [LED-1206]
LED3  GREEN  LED1206  [LED-1206]
LS1  BUZZER-PTH  [BUZZER-12MM]
Q1  600mA/40V  TRANS_NPN-P2N2222A  [TO-92]
R1  180  180OHM-0603-1/10W-1%  [0603]
R5  330  RESISTOR0603-RES  [0603-RES]
R6  330  RESISTOR0603-RES  [0603-RES]

### Nets
GND: LED2.C LED3.C Q1.3(E)
LEFT_LED: R6.2
N$1: Q1.2(B) R1.2
N$2: D1.A LS1.- Q1.1(C)
N$65: LED3.A R5.1
N$66: LED2.A R6.1
PWM: R1.1
RIGHT_LED: R5.2
VCC: D1.C LS1.+

### Library data of the parts
D1 = SparkFun-DiscreteSemi:DIODE: Diode These are standard reverse protection diodes and small signal diodes. SparkFun Products: SparkFun SparkPunk Sound Kit <https://www.sparkfun.com/products/11177> SparkFun ESP8266 Thing <https://www.sparkfun.com/products/13231>; PROD_ID: DIO-09646
LED2 LED3 = SparkFun-LED:LED: LED (Generic) Standard schematic elements and footprints for 5mm, 3mm, 1206, and 0603 sized LEDs. Generic LEDs with no color specified.
LS1 = SparkFun-Electromechanical:BUZZER: Buzzer Small round buzzers that operate around the audible 2kHz range. You can use these as speakers to create simple music or user interfaces. Variant Overview: PTH - Mini Speaker - PC Mount 12mm 2.048kHz <https://www.sparkfun.com/products/7950> PTH_KIT - Mini Speaker - PC Mount 12mm 2.048kHz <https://www.sparkfun.com/products/7950> KIT simplifies soldering by adding stop mask to one side of the pads. PTH_NO_SILK - Mini Speaker - PC Mount 12mm 2.048kHz <https://www.sparkfun.com/products/7950> No silkscreen indicator of buzzer outline. PTH_KIT_NO_SILK - Mini Speaker - PC Mount 12mm 2.048kHz <https://www.sparkfun.com/products/7950> KIT package w/o silkscreen SMD - Buzzer Audio Magnetic (CCV-084B16) SMD buzzer used on, e.g. the LilyPad Buzzer <https://www.sparkfun.com/products/8463> and RFID USB Reader <https://www.sparkfun.com/products/9963>. SMD_KIT - Buzzer Audio Magnetic (CCV-084B16) SMD Buzzer with elongated pins to make soldering easier. Used on the SparkFun Simon Says - Surface Mount Soldering Kit <https://www.sparkfun.com/products/10935>.; PROD_ID: COMP-08253; SF_SKU: COM-07950
Q1 = SparkFun-DiscreteSemi:TRANS_NPN: NPN transistor Current controlled devices typically used to amplify current or used as a switch. BC547 - COM-08928 <http://www.sparkfun.com/products/8928> (TO-92 45V 100mA) (1.Collector 2.Base 3.Emitter) 2N3904 - COM-00521 <http://www.sparkfun.com/products/521> (TO-92 40V 200mA) (1.Emitter 2.Base 3.Collector) P2N2222A - COM-12852 <http://www.sparkfun.com/products/12852> (TO-92 40V 600mA) (1.Collector 2.Base 3.Emitter); PROD_ID: TRANS-09536
R1 = SparkFun-Resistors:180OHM: 180Ω resistor A resistor is a passive two-terminal electrical component that implements electrical resistance as a circuit element. Resistors act to reduce current flow, and, at the same time, act to lower voltage levels within circuits. - Wikipedia; PROD_ID: RES-08788
R5 R6 = SparkFun:RESISTOR: Resistor Basic schematic elements and footprints for 0603, 1206, and PTH resistors.

## Board
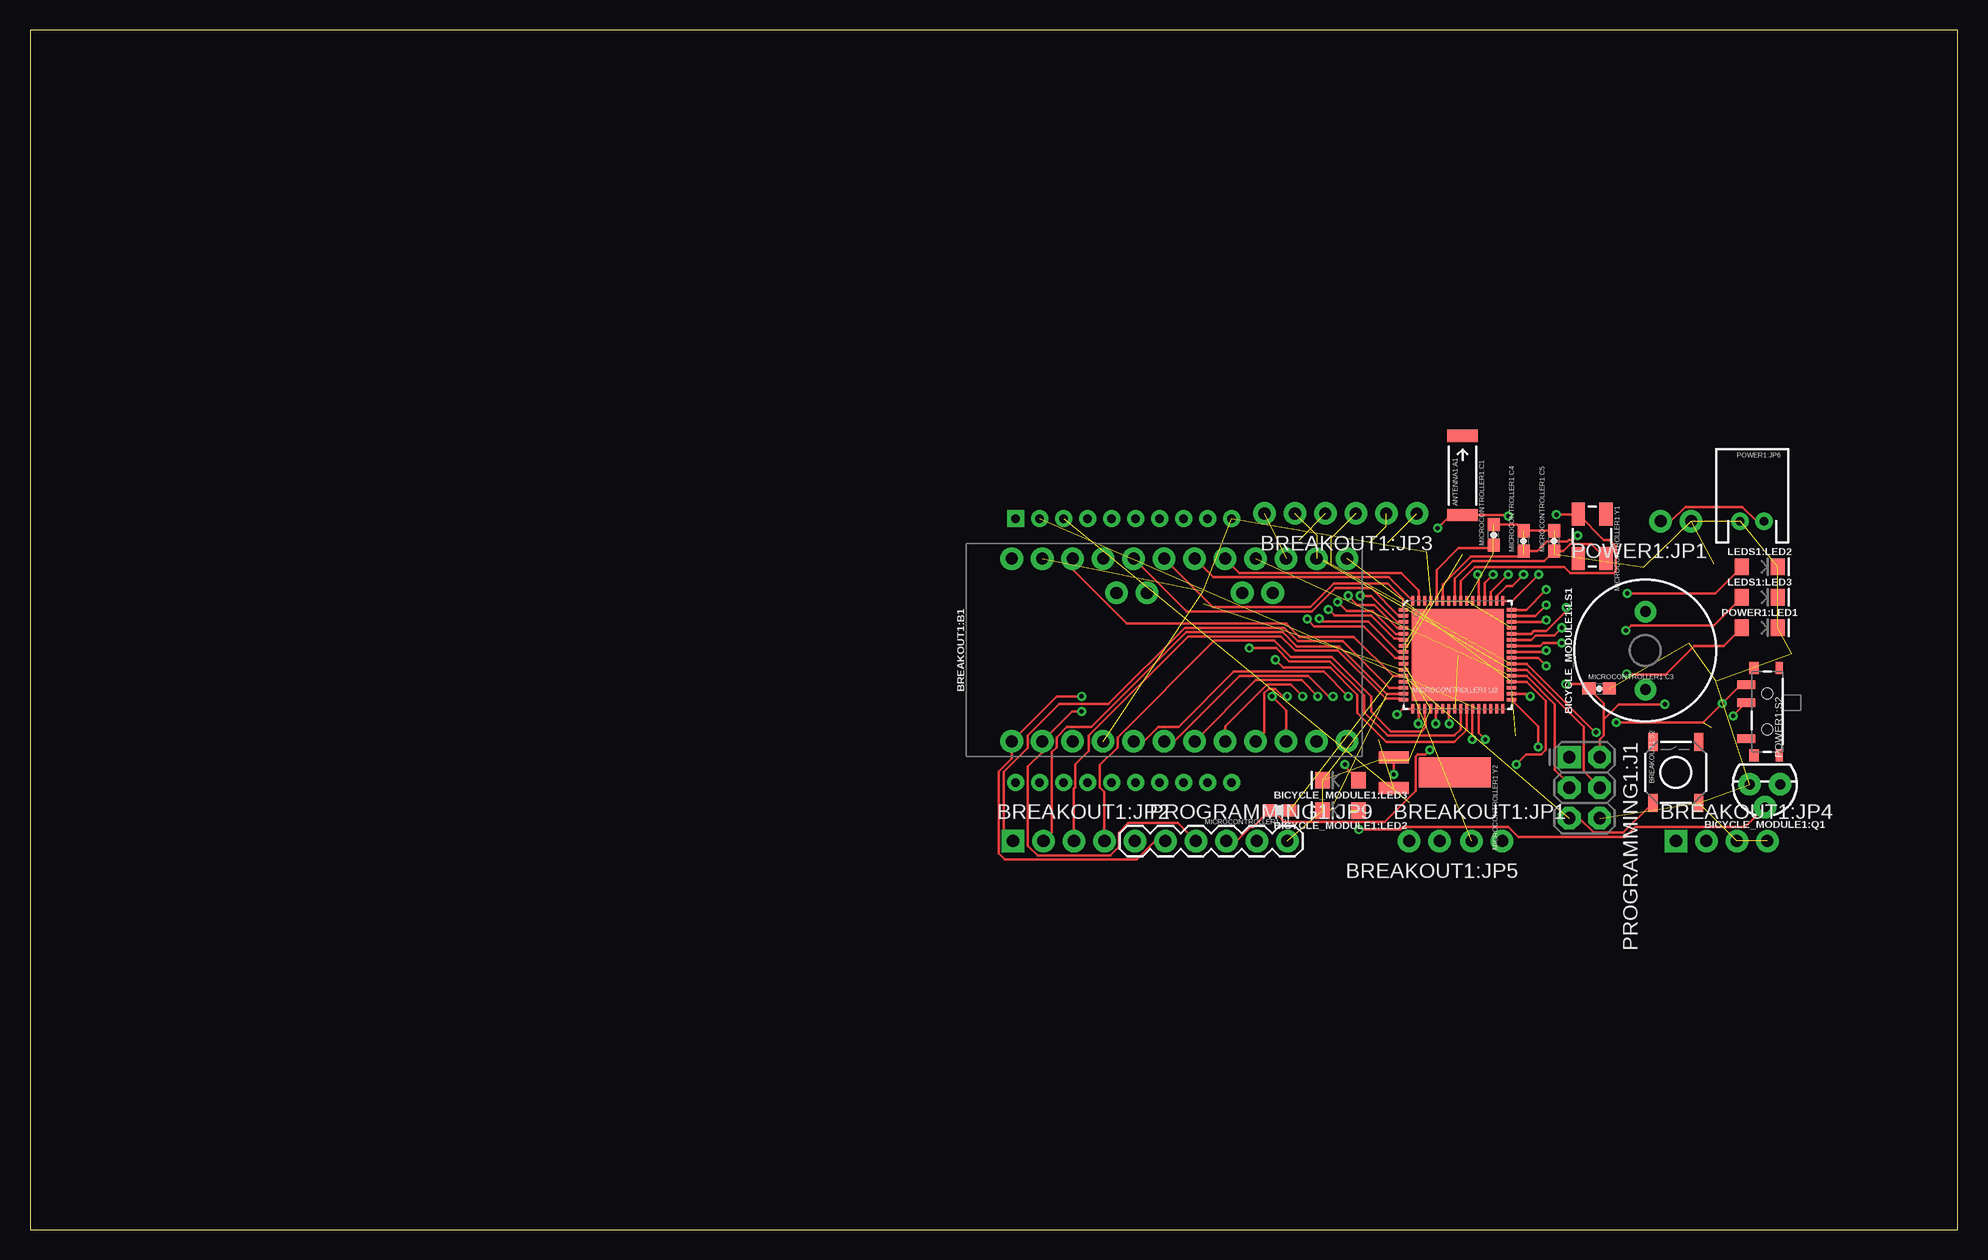
[diagram p8: board, top side]
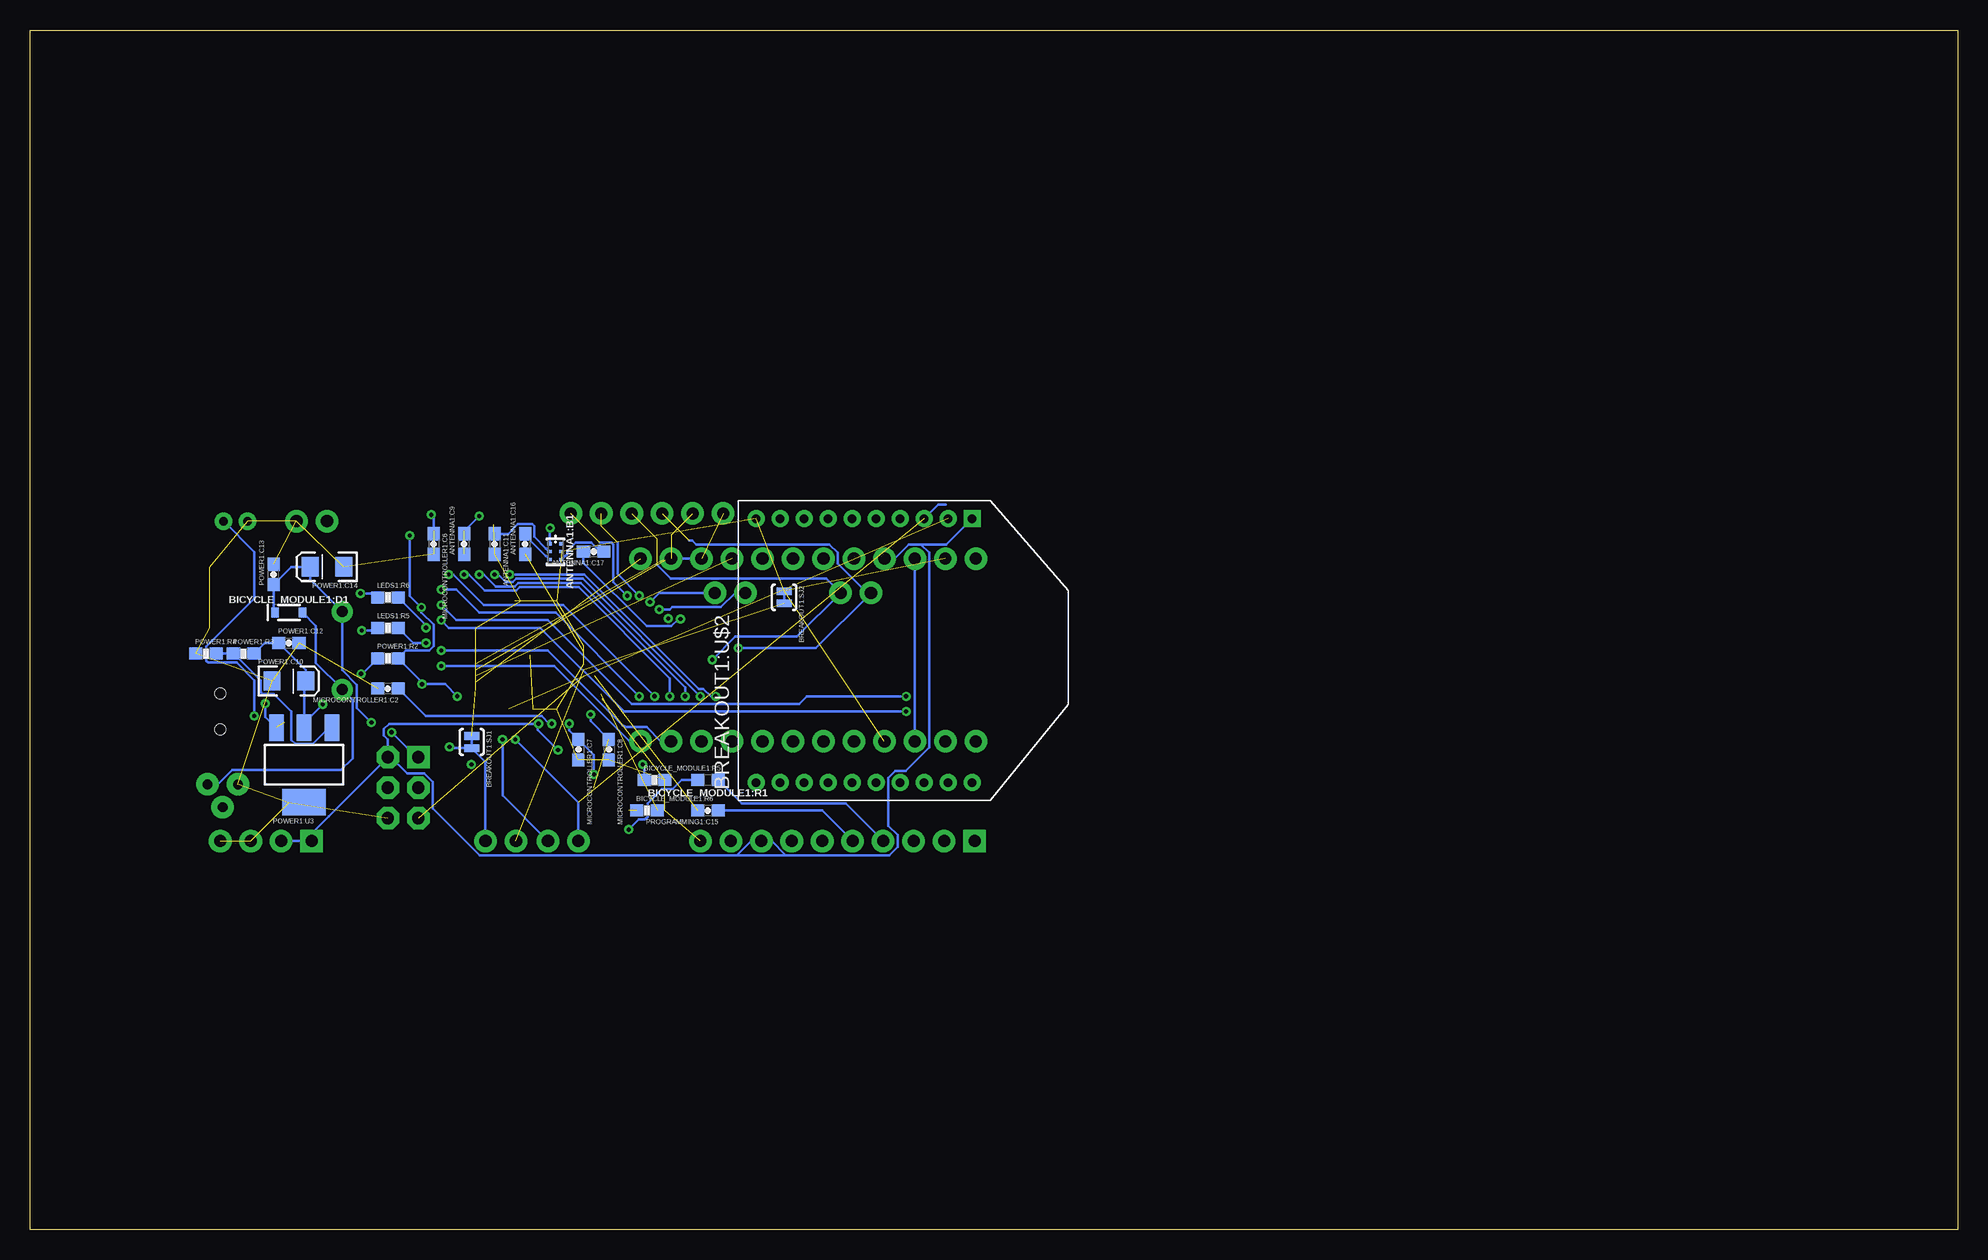
[diagram p9: board, bottom side, seen from below]

Size 160.63 x 100 mm. Coordinates in mm from the lower left corner, seen from the top.
Outline: 0,0 160.63,0 160.63,100 0,100 0,0
Copper layers (1*16): Top 0.035mm / dielectric 1.5mm / Bottom 0.035mm
Design rules "default *": minimum track width 6mil, minimum drill 0.35mm, track to track 6mil, track to pad 6mil, pad to pad 6mil, via to via 6mil, smd to smd 6mil, copper to edge 40mil, drill to drill 6mil, minimum pad ring 10mil, minimum via ring 8mil, stop-mask expansion 4mil, vias tented up to drill 0mil, thermal gap 10mil

### Footprints (pad centres in the part's own frame; a part is rotated, then mirrored left to right if it is on the bottom)
ANTENNA-CHIP5 = smd 1.016 x 2.54: FEED -3.302,0; NC 3.302,0
BALUN-0805 = smd 0.27 x 0.4: 1 -0.65,-0.495; 2 0,-0.495; 3 0.65,-0.495; 4 0.65,0.505; 5 0,0.505; 6 -0.65,0.505
0603-CAP = smd 1.1 x 1: 1 -0.85,0; 2 0.85,0
SOD-323 = smd 0.63 x 0.83: A 1.15,0; C -1.15,0
LED-1206 = smd 1.2 x 1.4: A -1.5,0; C 1.5,0
BUZZER-12MM = drill 0.9 pad 1.778: + 3.25,0; - -3.25,0
TO-92 = drill 0.813 pad 1.88: 1 -1.27,0; 2 0,1.905; 3 1.27,0
0603 = smd 1.1 x 1: 1 -0.85,0; 2 0.85,0
0603-RES = smd 1.1 x 1: 1 -0.85,0; 2 0.85,0
ARDUINO_PRO_MINI = drill 1.016 pad 1.88: 1 -7.62,12.7; 2 -7.62,10.16; 3 -7.62,7.62; 4 -7.62,5.08; 5 -7.62,2.54; 6 -7.62,0; 7 -7.62,-2.54; 8 -7.62,-5.08; 9 -7.62,-7.62; 10 -7.62,-10.16; 11 -7.62,-12.7; 12 -7.62,-15.24; 13 7.62,-15.24; 14 7.62,-12.7; 15 7.62,-10.16; 16 7.62,-7.62; 17 7.62,-5.08; 18 7.62,-2.54; 19 7.62,0; 20 7.62,2.54; 21 7.62,5.08; 22 7.62,7.62; 23 7.62,10.16; 24 7.62,12.7; A4 4.763,1.429; A5 4.763,3.969; A6 4.763,-9.049; A7 4.763,-6.509
1X02_NO_SILK = drill 1.016 pad 1.88: 1 0,0; 2 2.54,0
1X04_NO_SILK = drill 1.016 pad 1.88 square: 1 0,0 | drill 1.016 pad 1.88: 2 2.54,0; 3 5.08,0; 4 7.62,0
1X06_NS = drill 1.016 pad 1.88: 1 0,0; 2 2.54,0; 3 5.08,0; 4 7.62,0; 5 10.16,0; 6 12.7,0
TACTILE_SWITCH_SMD = smd 1.524 x 0.762: 1 -2.54,1.905; 2 2.54,1.905; 3 -2.54,-1.905; 4 2.54,-1.905
SJ_2S-TRACE = smd 0.635 x 1.27: 1 -0.508,0; 2 0.508,0
XBEE = drill 0.7 pad 1.422 square: 1 -11,5.5 | drill 0.7 pad 1.422: 2 -11,3.5; 3 -11,1.5; 4 -11,-0.5; 5 -11,-2.5; 6 -11,-4.5; 7 -11,-6.5; 8 -11,-8.5; 9 -11,-10.5; 10 -11,-12.5; 11 11,-12.5; 12 11,-10.5; 13 11,-8.5; 14 11,-6.5; 15 11,-4.5; 16 11,-2.5; 17 11,-0.5; 18 11,1.5; 19 11,3.5; 20 11,5.5
QFN-64 = smd 0.8 x 0.28: 1 -4.5,3.75; 2 -4.5,3.25; 3 -4.5,2.75; 4 -4.5,2.25; 5 -4.5,1.75; 6 -4.5,1.25; 7 -4.5,0.75; 8 -4.5,0.25; 9 -4.5,-0.25; 10 -4.5,-0.75; 11 -4.5,-1.25; 12 -4.5,-1.75; 13 -4.5,-2.25; 14 -4.5,-2.75; 15 -4.5,-3.25; 16 -4.5,-3.75; 33 4.5,-3.75; 34 4.5,-3.25; 35 4.5,-2.75; 36 4.5,-2.25; 37 4.5,-1.75; 38 4.5,-1.25; 39 4.5,-0.75; 40 4.5,-0.25; 41 4.5,0.25; 42 4.5,0.75; 43 4.5,1.25; 44 4.5,1.75; 45 4.5,2.25; 46 4.5,2.75; 47 4.5,3.25; 48 4.5,3.75 | smd 0.28 x 0.8: 17 -3.75,-4.5; 18 -3.25,-4.5; 19 -2.75,-4.5; 20 -2.25,-4.5; 21 -1.75,-4.5; 22 -1.25,-4.5; 23 -0.75,-4.5; 24 -0.25,-4.5; 25 0.25,-4.5; 26 0.75,-4.5; 27 1.25,-4.5; 28 1.75,-4.5; 29 2.25,-4.5; 30 2.75,-4.5; 31 3.25,-4.5; 32 3.75,-4.5; 49 3.75,4.5; 50 3.25,4.5; 51 2.75,4.5; 52 2.25,4.5; 53 1.75,4.5; 54 1.25,4.5; 55 0.75,4.5; 56 0.25,4.5; 57 -0.25,4.5; 58 -0.75,4.5; 59 -1.25,4.5; 60 -1.75,4.5; 61 -2.25,4.5; 62 -2.75,4.5; 63 -3.25,4.5; 64 -3.75,4.5 | smd 7.65 x 7.65: 65 0,0
CRYSTAL-SMD-5X3 = smd 1.9 x 1.1: 1 -1.85,-1.15; 2 1.85,-1.15; 3 1.85,1.15; 4 -1.85,1.15
CRYSTAL-32KHZ-SMD = smd 2.5 x 6: SHEILD 0,5.08 | smd 1 x 2.5: X1 -1.27,0; X2 1.27,0
EIA3216 = smd 1.4 x 1.6: A 1.4,0; C -1.4,0
JST-2-PTH = drill 0.7 pad 1.448: 1 -1,0; 2 1,0
SWITCH-SPST-SMD-A = smd 0.7 x 1.5: 1 -2.25,-1.75; 2 -0.75,-1.75; 3 2.25,-1.75 | smd 1 x 0.6: GND1 -3.65,1; GND3 3.65,1 | smd 1 x 0.8: GND2 -3.65,-1.1; GND4 3.65,-1.1 | hole 0.9: -1.5,0; 1.5,0
SOT223 = smd 1.219 x 2.235: 1 -2.311,-3.099; 2 0,-3.099; 3 2.311,-3.099 | smd 3.6 x 2.2: 4 0,3.099
2X3-NS = drill 1.016 pad 1.88 square: 1 -2.54,-1.27 | drill 1.016 pad 1.88 octagon: 2 -2.54,1.27; 3 0,-1.27; 4 0,1.27; 5 2.54,-1.27; 6 2.54,1.27
FTDI_BASIC = drill 1.016 pad 1.88: CTS 10.16,0; DTR 0,0; GND 12.7,0; RXI 2.54,0; TXO 5.08,0; VCC 7.62,0

### Placement (x,y rotation side)
ANTENNA1:A1  ANTENNA2SMD5  [ANTENNA-CHIP5]  119.38,62.87 90 top
ANTENNA1:B1  748421245  [BALUN-0805]  116.84,56.52 270 bottom
ANTENNA1:C9  0.75pF  [0603-CAP]  124.46,57.15 90 bottom
ANTENNA1:C11  22pF  [0603-CAP]  121.92,57.15 270 bottom
ANTENNA1:C16  JUMP  [0603-CAP]  119.38,57.15 90 bottom
ANTENNA1:C17  JUMP  [0603-CAP]  113.67,56.52 180 bottom
BICYCLE_MODULE1:D1  250mA/100V  [SOD-323]  139.06,51.44 0 bottom
BICYCLE_MODULE1:LED2  GREEN  [LED-1206]  109.22,34.92 180 top
BICYCLE_MODULE1:LED3  GREEN  [LED-1206]  109.22,37.47 180 top
BICYCLE_MODULE1:LS1  BUZZER-PTH  [BUZZER-12MM]  134.62,48.26 90 top
BICYCLE_MODULE1:Q1  600mA/40V  [TO-92]  144.58,37.11 180 top
BICYCLE_MODULE1:R1  180  [0603]  104.14,37.47 180 bottom
BICYCLE_MODULE1:R5  330  [0603-RES]  108.58,37.47 0 bottom
BICYCLE_MODULE1:R6  330  [0603-RES]  109.22,34.92 0 bottom
BREAKOUT1:B1  ARDUINO_PRO_MINI  [ARDUINO_PRO_MINI]  94.51,48.31 90 top
BREAKOUT1:JP1  [1X02_NO_SILK]  114.94,32.38 0 top
BREAKOUT1:JP2  [1X04_NO_SILK]  81.92,32.38 0 top
BREAKOUT1:JP3  [1X06_NS]  115.57,59.69 180 top
BREAKOUT1:JP4  [1X04_NO_SILK]  137.16,32.38 0 top
BREAKOUT1:JP5  [1X02_NO_SILK]  122.68,32.38 180 top
BREAKOUT1:S2  [TACTILE_SWITCH_SMD]  137.16,38.1 90 top
BREAKOUT1:SJ1  [SJ_2S-TRACE]  123.83,40.64 270 bottom
BREAKOUT1:SJ2  [SJ_2S-TRACE]  97.79,52.7 270 bottom
BREAKOUT1:U$2  XBEE  [XBEE]  87.63,48.26 270 bottom
LEDS1:LED2  GREEN  [LED-1206]  144.15,55.24 0 top
LEDS1:LED3  GREEN  [LED-1206]  144.15,52.7 0 top
LEDS1:R5  330  [0603-RES]  130.81,50.16 0 bottom
LEDS1:R6  330  [0603-RES]  130.81,52.7 0 bottom
MICROCONTROLLER1:C1  1uF  [0603-CAP]  121.97,57.91 90 top
MICROCONTROLLER1:C2  1uF  [0603-CAP]  130.81,45.09 180 bottom
MICROCONTROLLER1:C3  1uF  [0603-CAP]  130.76,45.09 0 top
MICROCONTROLLER1:C4  1uF  [0603-CAP]  124.46,57.4 90 top
MICROCONTROLLER1:C5  12pF  [0603-CAP]  127,57.4 90 top
MICROCONTROLLER1:C6  12pF  [0603-CAP]  127,57.15 270 bottom
MICROCONTROLLER1:C7  12pF  [0603-CAP]  114.94,40.01 270 bottom
MICROCONTROLLER1:C8  12pF  [0603-CAP]  112.39,40.01 270 bottom
MICROCONTROLLER1:R1  10k  [0603-RES]  104.14,34.92 180 top
MICROCONTROLLER1:U2  ATMEGA128RFA1  [QFN-64]  118.97,47.9 0 top
MICROCONTROLLER1:Y1  16MHz  [CRYSTAL-SMD-5X3]  130.18,57.78 270 top
MICROCONTROLLER1:Y2  32.768kHz  [CRYSTAL-32KHZ-SMD]  113.67,38.1 270 top
POWER1:C10  10uF  [EIA3216]  139.06,45.72 0 bottom
POWER1:C12  1uF  [0603-CAP]  139.06,48.9 0 bottom
POWER1:C13  0.1uF  [0603-CAP]  140.34,54.61 90 bottom
POWER1:C14  10uF  [EIA3216]  135.89,55.24 180 bottom
POWER1:JP1  [1X02_NO_SILK]  138.43,59.05 180 top
POWER1:JP6  [JST-2-PTH]  143.51,59.05 0 top
POWER1:LED1  RED  [LED-1206]  144.15,50.16 0 top
POWER1:R2  1k  [0603-RES]  130.81,47.62 0 bottom
POWER1:R3  240  [0603-RES]  142.82,48.01 0 bottom
POWER1:R4  390  [0603-RES]  145.97,48.01 0 bottom
POWER1:S2  [SWITCH-SPST-SMD-A]  144.78,43.18 270 top
POWER1:U3  LM1117  [SOT223]  137.79,38.73 180 bottom
PROGRAMMING1:C15  0.1uF  [0603-CAP]  104.14,34.92 180 bottom
PROGRAMMING1:J1  ISP  [2X3-NS]  129.54,36.83 270 top
PROGRAMMING1:JP9  FTDI  [FTDI_BASIC]  92.08,32.38 0 top

### Tracks (layer width: path | path; a pad name or v marks a point on that pad's centre or on a via)
3.3V  (via drill 0.35)  (1 unrouted)
  Top 0.203: MICROCONTROLLER1:U2.23 118.22,42.2 v118.26,42.16 | MICROCONTROLLER1:U2.34 124.81,44.65 v125.02,44.45 | PROGRAMMING1:J1.2 130.81,40.86 131.14,41.19 131.14,42.52 | 131.14,42.52 131.14,43.86 MICROCONTROLLER1:C3.1 129.53,45.47 v127.97,45.47 | MICROCONTROLLER1:U2.44 125.09,49.65 125.32,49.89 126.34,49.89 128.02,51.56 v128.02,51.87 | v136.25,43.79 132.41,43.79 131.14,42.52 | PROGRAMMING1:JP9.VCC 100.55,32.38 101.74,33.58 101.94,33.58 MICROCONTROLLER1:R1.2 103.58,34.92 104.53,33.97 112.92,33.97 115.49,36.55 115.49,39.45 115.64,39.6 116.26,39.6 v116.64,39.98 | 124.56,56.55 MICROCONTROLLER1:C4.1 | 124.56,56.55 125.59,56.55 126.39,57.36 128.09,57.36 128.22,57.49 128.62,57.49 v128.98,57.86 | 124.56,56.55 124.11,56.11 120.06,56.11 117.72,53.77 MICROCONTROLLER1:U2.59
  Bottom 0.203: 127.91,45.47 v127.97,45.47 | 127.91,45.47 126.03,45.47 v125.02,44.45 | 127.91,45.47 127.91,45.58 POWER1:R2.2 129.32,48.26 127.37,48.26 127,48.63 127,50.43 128.02,51.44 v128.02,51.87 128.98,52.83 v128.98,57.86 | POWER1:R3.2 141.09,48.9 POWER1:C12.1 137.66,46.65 POWER1:C10.A arc-90 137.79,45.59 POWER1:U3.2 137.79,42.24 v136.25,43.79 | BREAKOUT1:JP4.2 BREAKOUT1:JP4.1 137.16,33.01 135.74,34.43 135.74,34.44 PROGRAMMING1:J1.2 130.81,39.62 | 130.81,39.62 130.81,40.86 131.14,41.19 131.14,41.72 130.69,42.16 118.31,42.16 | 118.31,42.16 v118.26,42.16 | 99.97,32.38 PROGRAMMING1:JP9.VCC 98.84,32.38 | 99.97,32.38 100.55,32.38 101.74,31.19 102.87,31.19 | 130.81,39.62 129.21,38.02 127.78,38.02 127.08,37.32 127.08,35.09 123.18,31.19 102.87,31.19 | BREAKOUT1:U$2.1 84.27,57.12 87.39,57.12 | 88.58,55.93 BREAKOUT1:B1.21 88.58,55.93 | 88.58,55.93 87.39,57.12 | v116.64,39.98 118.31,41.66 118.31,42.16 | 87.39,57.12 86.4,57.12 85.7,56.42 85.7,40.2 87.67,38.23 88.53,38.23 89.09,37.66 89.09,33.63 88.34,32.88 88.34,31.89 89.04,31.19 97.23,31.19 | 88.58,55.93 87.39,57.12 | 98.84,32.38 99.97,32.38 | 97.23,31.19 97.48,31.19 | 97.48,31.19 97.65,31.19 | 97.65,31.19 98.84,32.38 | 97.65,31.19 97.48,31.19 | 97.48,31.19 97.23,31.19 | 98.84,32.38 97.65,31.19 | 97.48,31.19 102.87,31.19
A0
  Top 0.203: MICROCONTROLLER1:U2.63 115.72,53.29 114.28,54.74 100.79,54.74 BREAKOUT1:B1.17
A1
  Top 0.203: MICROCONTROLLER1:U2.64 113.25,54.38 98.6,54.38 BREAKOUT1:B1.18
A2
  Top 0.203: MICROCONTROLLER1:U2.1 114.43,51.7 114.43,52.58 113.16,53.85 108.65,53.85 106.68,51.88 98.56,51.88 BREAKOUT1:B1.19
A3
  Top 0.203: MICROCONTROLLER1:U2.2 114.07,51.15 111.76,53.47 108.77,53.47 106.83,51.52 96.38,51.52 BREAKOUT1:B1.20
A4  (via drill 0.35)  (1 unrouted)
  Top 0.203: MICROCONTROLLER1:U2.3 113.94,50.65 111.76,52.83 v110.87,52.83
  Bottom 0.203: 113.15,57.27 112.16,57.27 112.01,57.12 112.01,53.97 v110.87,52.83
A5  (via drill 0.35)  (2 unrouted)
  Top 0.203: MICROCONTROLLER1:U2.4 113.93,50.15 112.01,52.07 110.62,52.07 v109.86,52.83
  Bottom 0.203: v109.86,52.83 111.66,54.63 111.66,57.27
A6  (via drill 0.35)
  Top 0.203: MICROCONTROLLER1:U2.5 113.8,49.65 111.89,51.56 109.73,51.56 v108.97,52.32
  Bottom 0.203: v108.97,52.32 108.22,53.07 BREAKOUT1:B1.A6
A7  (via drill 0.35)
  Top 0.203: MICROCONTROLLER1:U2.6 114.37,49.26 113.69,49.26 111.77,51.18 108.71,51.18 v108.2,51.69
  Bottom 0.203: v108.2,51.69 107.31,51.69 107.12,51.88 103.07,51.88 101.87,53.07 BREAKOUT1:B1.A7
ANTENNA1:N$62
  Bottom 0.203: ANTENNA1:B1.2 117.6,56.78 117.64,56.78 118.63,57.76 118.63,58.66 118.78,58.8 119.98,58.8 120.79,58 ANTENNA1:C11.1
ANTENNA1:N$63
  Bottom 0.203: ANTENNA1:B1.3 117.6,56.13 117.64,56.13 119.38,57.87 ANTENNA1:C16.2
ANTENNA1:N$64
  Bottom 0.203: ANTENNA1:B1.4 116.07,56.13 116.03,56.13 115.88,56.27 115.88,56.56 115.17,57.27 113.86,57.27 113.11,56.52 ANTENNA1:C17.1
ANTENNA1:RFANT  (via drill 0.35)
  Top 0.203: v117.3,58.47 118.39,59.56 ANTENNA1:A1.FEED 121.36,59.56 121.37,59.57 123.11,59.57 v123.19,59.49
  Bottom 0.203: ANTENNA1:B1.1 117.33,58.43 v117.3,58.47 | v123.19,59.49 124.46,58.22 ANTENNA1:C9.2
AVDD
  Top 0.203: MICROCONTROLLER1:C1.1 121.7,56.79 119.02,56.79 117.22,54.99 MICROCONTROLLER1:U2.60
BICYCLE_MODULE1:N$1  (via drill 0.35)
  Top 0.203: v110.74,33.34 114.2,33.34 114.44,33.58 123.18,33.58 124.02,32.74 132.94,32.74 133.78,33.58 142.95,33.58 BICYCLE_MODULE1:Q1.2
  Bottom 0.203: v110.74,33.34 109.91,34.17 109.42,34.17 109.17,34.41 109.17,35.53 107.99,36.71 107.08,36.71 106.33,37.47 BICYCLE_MODULE1:R1.2
BICYCLE_MODULE1:N$2
  Bottom 0.203: BICYCLE_MODULE1:D1.A 136.8,50.32 136.8,47.24 134.62,45.06 BICYCLE_MODULE1:LS1.- 133.76,44.15 133.76,39.27 134.72,38.3 143.8,38.3 145,37.11 BICYCLE_MODULE1:Q1.1
BICYCLE_MODULE1:N$65  (via drill 0.35)
  Top 0.203: BICYCLE_MODULE1:LED3.A 109.58,38.61 v109.58,38.76
  Bottom 0.203: v109.58,38.76 109.44,38.62 BICYCLE_MODULE1:R5.1
BICYCLE_MODULE1:N$66  (1 unrouted)
CLKI  (via drill 0.35)
  Top 0.203: MICROCONTROLLER1:U2.33 125.68,41.95 v125.68,40.23
  Bottom 0.203: BREAKOUT1:JP5.1 122.68,38.99 123.64,39.94 123.68,39.9 123.97,39.9 | v125.68,40.23 125.58,40.13 124.18,40.13 124.18,40.11 123.97,39.9 | BREAKOUT1:SJ1.2 123.83,40.05 123.97,39.9
DVDD  (via drill 0.35)
  Top 0.203: MICROCONTROLLER1:U2.22 MICROCONTROLLER1:U2.21 117.14,43.33 v117.14,42.16
  Bottom 0.203: v117.14,42.16 117.37,42.16 118,42.8 127.67,42.8 MICROCONTROLLER1:C2.1
GND  (41 unrouted)
  Top 0.203: MICROCONTROLLER1:C5.2 MICROCONTROLLER1:C4.2 123.95,58.76 MICROCONTROLLER1:C1.2
LEDS1:N$65  (via drill 0.35)
  Top 0.203: v132.99,49.94 133.43,50.37 140.31,50.37 LEDS1:LED3.A
  Bottom 0.203: LEDS1:R5.1 131.89,49.94 v132.99,49.94
LEDS1:N$66  (via drill 0.35)
  Top 0.203: LEDS1:LED2.A 140.44,53.03 v133.1,53.03
  Bottom 0.203: LEDS1:R6.1 131.99,53.03 v133.1,53.03
MICROCONTROLLER1:N$57
  Top 0.203: MICROCONTROLLER1:U2.57 118.72,54.26 120.21,55.75 126.2,55.75 MICROCONTROLLER1:C5.1 127.78,56.55 128.37,57.14 130.12,57.14 MICROCONTROLLER1:Y1.3
MICROCONTROLLER1:N$58  (via drill 0.35)
  Top 0.203: v127.2,59.59 128.98,59.59 MICROCONTROLLER1:Y1.1 131.16,57.49 131.62,57.49 132.13,56.99 132.13,54.88 131.98,54.73 128.37,54.73 127.86,55.24 120.39,55.24 119.22,54.08 MICROCONTROLLER1:U2.56
  Bottom 0.203: v127.2,59.59 127,59.38 MICROCONTROLLER1:C6.1
MICROCONTROLLER1:N$59  (via drill 0.35)
  Top 0.203: MICROCONTROLLER1:U2.18 115.72,42.19 v115.7,42.16 | MICROCONTROLLER1:Y2.X1 113.67,37.97 v113.64,37.95
  Bottom 0.203: v115.7,42.16 115.7,41.62 MICROCONTROLLER1:C7.1 113.64,39.56 v113.64,37.95
MICROCONTROLLER1:N$60  (via drill 0.35)  (1 unrouted)
  Top 0.203: MICROCONTROLLER1:U2.17 114.4,43.4 v113.92,42.93
  Bottom 0.203: MICROCONTROLLER1:C8.1 113.92,42.38 v113.92,42.93
MISO  (via drill 0.35)  (2 unrouted)
  Top 0.203: v130.5,41.45 130.46,41.41 124.72,47.15 MICROCONTROLLER1:U2.39
  Bottom 0.203: 107.85,55.83 107.75,55.93 BREAKOUT1:B1.15 | v130.5,41.45 128.42,39.37 PROGRAMMING1:J1.1
MOSI  (3 unrouted)
  Top 0.203: PROGRAMMING1:J1.4 129.46,38.18 129.46,41.91 124.71,46.65 MICROCONTROLLER1:U2.38 | BREAKOUT1:B1.14 107.37,55.78 107.75,55.78
PB4  (via drill 0.35)
  Top 0.203: v126.36,46.99 125.7,47.65 MICROCONTROLLER1:U2.40
  Bottom 0.203: v126.36,46.99 116.97,46.99 110.67,40.69 BREAKOUT1:B1.12
PB5  (via drill 0.35)
  Top 0.203: MICROCONTROLLER1:U2.41 126.26,48.15 v126.36,48.26
  Bottom 0.203: v126.36,48.26 117.47,48.26 111.26,42.04 111,41.88 109.26,41.88 108.06,40.69 BREAKOUT1:B1.11
PB6  (via drill 0.35)
  Top 0.203: v127.64,48.9 v127.63,48.89 126.1,48.89 125.86,48.65 MICROCONTROLLER1:U2.42
  Bottom 0.203: LEDS1:R5.2 128.69,48.9 v127.64,48.9
PB7  (via drill 0.35)
  Top 0.203: MICROCONTROLLER1:U2.43 125.09,49.15 125.47,49.53 127,49.53 v127.64,50.16
  Bottom 0.203: LEDS1:R6.2 127.64,50.38 v127.64,50.16
PE2  (via drill 0.35)
  Top 0.203: v109.86,44.45 107.8,46.51 100.33,46.51 95.71,41.88 94.02,41.88 92.83,40.69 BREAKOUT1:B1.5 | v126.36,53.34 124.68,51.65 MICROCONTROLLER1:U2.48
  Bottom 0.203: v126.36,53.34 125.09,53.34 123.19,51.44 116.84,51.44 v109.86,44.45
PE3  (via drill 0.35)
  Top 0.203: MICROCONTROLLER1:U2.49 123.52,52.4 v125.73,54.61 | v108.58,44.45 108.21,44.45 106.51,46.15 100.82,46.15 95.36,40.69 BREAKOUT1:B1.6
  Bottom 0.203: v108.58,44.45 116.2,52.07 122.81,52.07 125.35,54.61 v125.73,54.61
PE4  (via drill 0.35)
  Top 0.203: v124.46,54.61 123.51,53.66 123.08,53.66 122.22,52.8 MICROCONTROLLER1:U2.50 | v107.31,44.45 105.97,45.79 102.16,45.79 BREAKOUT1:B1.7
  Bottom 0.203: v124.46,54.61 124.08,54.61 122.74,53.27 120.09,53.27 119.82,53.54 114.9,53.54 107.31,45.95 v107.31,44.45
PE5  (via drill 0.35)
  Top 0.203: v123.19,54.61 121.72,53.14 MICROCONTROLLER1:U2.51 | v106.05,44.45 105.06,45.44 103.1,45.44 99.59,41.94 BREAKOUT1:B1.8
  Bottom 0.203: v123.19,54.61 122.81,54.61 121.83,53.62 120.24,53.62 119.96,53.9 114.76,53.9 106.05,45.19 v106.05,44.45
PE6  (via drill 0.35)
  Top 0.203: v104.78,44.45 104.4,44.45 103.77,45.08 103.24,45.08 102.87,44.71 102.87,41.43 BREAKOUT1:B1.9 | v121.92,54.61 121.22,53.91 MICROCONTROLLER1:U2.52
  Bottom 0.203: v121.92,54.61 121.61,54.61 120.98,53.98 120.39,53.98 120.11,54.25 114.58,54.25 v104.78,44.45
PE7  (via drill 0.35)
  Top 0.203: v120.65,54.61 120.72,54.54 MICROCONTROLLER1:U2.53 | BREAKOUT1:B1.10 104.67,43.28 v103.5,44.45
  Bottom 0.203: v103.5,44.45 103.88,44.45 104.51,45.08 104.9,45.08 114.43,54.61 v120.65,54.61
PG0
  Top 0.203: MICROCONTROLLER1:U2.14 114.4,45.15 114.39,45.16 113.28,45.16 109.39,49.05 105.64,49.05 104.53,50.16 96.21,50.16 89.86,43.81 85.79,43.81 83.16,41.19 83.16,40.13 81.17,38.14 81.17,33.13 BREAKOUT1:JP2.1
PG1  (1 unrouted)
  Top 0.203: MICROCONTROLLER1:U2.15 113.08,44.65 109.11,48.62 105.57,48.62 104.38,49.81 96.36,49.81 88.44,41.88 86.4,41.88 85.55,41.03 85.55,40.2 85.17,39.81 85.17,33.09 BREAKOUT1:JP2.2
PG2  (1 unrouted)
  Top 0.203: MICROCONTROLLER1:U2.16 114.37,44.26 112.97,44.26 108.97,48.26 105.42,48.26 104.23,49.45 96.5,49.45 88.24,41.19 88.24,39.91 87.09,38.76 87.09,36.86 87,36.76 BREAKOUT1:JP2.3
PG5
  Top 0.203: MICROCONTROLLER1:U2.19 116.22,42.53 116.33,42.43 116.33,41.9 115.96,41.53 113.41,41.53 111.76,43.18 111.76,44.45 108.48,47.73 105.08,47.73 103.71,49.09 98.69,49.09 90.63,41.03 90.63,40.2 89.17,38.73 89.17,36.86 89.53,36.49 BREAKOUT1:JP2.4
  Bottom 0.203: BICYCLE_MODULE1:R1.1 101.33,35.51 92.66,35.51 BREAKOUT1:JP2.4
POWER1:FB
  Bottom 0.203: POWER1:U3.1 135.71,41.83 137.08,40.46 138.51,40.46 138.87,40.82 138.87,43.2 140.33,44.67 141.27,44.67 141.42,44.81 141.42,45.75 POWER1:R3.1 POWER1:R4.2
POWER1:N$61  (via drill 0.35)
  Top 0.203: v133.04,46.33 133.1,46.28 136.3,46.28 138.67,48.65 141.13,48.65 POWER1:LED1.A
  Bottom 0.203: POWER1:R2.1 132.96,46.33 v133.04,46.33
POWER1:N$67  (via drill 0.35)
  Top 0.203: POWER1:JP6.2 143.89,59.05 142.7,60.25 137.94,60.25 136.74,59.05 POWER1:JP1.2 | POWER1:S2.2 141.94,42.84 v141.94,42.82
  Bottom 0.203: POWER1:JP6.2 141.94,56.48 141.94,52.6 145.93,48.61 145.93,47.4 145.78,47.25 143.42,47.25 141.94,45.76 v141.94,42.82
PROGRAMMING1:DTR
  Bottom 0.203: PROGRAMMING1:JP9.DTR 94.61,34.92 PROGRAMMING1:C15.1
RESET  (3 unrouted)
  Top 0.203: MICROCONTROLLER1:U2.12 113.59,46.15 110.33,49.42 105.78,49.42 104.68,50.52 91.41,50.52 86.89,55.04 BREAKOUT1:B1.22 | BREAKOUT1:S2.1 132.79,33.1 130.32,33.1 129.12,34.29 PROGRAMMING1:J1.5
  Bottom 0.203: BREAKOUT1:B1.3 BREAKOUT1:B1.22
RFN  (via drill 0.35)
  Top 0.203: MICROCONTROLLER1:U2.9 113.76,47.65 111.13,50.29 107.03,50.29 v106.43,50.89
  Bottom 0.203: v106.43,50.89 106.58,50.89 107.18,50.3 109.23,50.3 114.52,55.58 ANTENNA1:C17.2
RFP  (via drill 0.35)  (1 unrouted)
  Top 0.203: MICROCONTROLLER1:U2.8 114.03,48.15 111.51,50.67 107.7,50.67 v107.44,50.93
RX0  (via drill 0.35)
  Top 0.203: MICROCONTROLLER1:U2.46 126.22,50.65 v126.36,50.8 | v87.63,43.18 86.84,43.18 BREAKOUT1:B1.2 84.35,39.78 83.17,38.59 83.17,31.99 83.96,31.19 90.03,31.19 90.73,31.89 90.73,33.08 91.54,33.89 95.65,33.89 PROGRAMMING1:JP9.TXO
  Bottom 0.203: v126.36,50.8 125.73,50.16 118.11,50.16 111.12,43.18 v87.63,43.18
RX1  (via drill 0.35)  (1 unrouted)
  Top 0.203: v120.19,40.84 120.19,43.37 MICROCONTROLLER1:U2.27
  Bottom 0.203: BREAKOUT1:JP1.1 114.94,35.59 v120.19,40.84 | BREAKOUT1:U$2.3 84.94,60.45 84.33,60.45
SCK  (1 unrouted)
  Top 0.203: PROGRAMMING1:J1.3 128.27,37.13 127.08,38.33 127.08,43.79 124.71,46.15 MICROCONTROLLER1:U2.37
SCL  (via drill 0.35)  (1 unrouted)
  Top 0.203: v101.6,48.46 103.83,48.46 104.93,47.37 108.33,47.37 111.19,44.51 111.19,43.12 113.13,41.18 118.7,41.18 119.22,41.7 MICROCONTROLLER1:U2.25
  Bottom 0.203: 90.71,52.91 BREAKOUT1:B1.A5 | 90.71,52.91 95.16,48.46 v101.6,48.46 101.92,48.46 | 90.71,52.91 93.32,55.52 93.32,56.42 94.02,57.12 105.13,57.12 105.46,57.45 105.72,57.45
SDA  (via drill 0.35)  (2 unrouted)
  Top 0.203: v103.78,47.5 104.42,46.86 108.34,46.86 110.62,44.58 110.62,43.05 113.03,40.64 118.71,40.64 119.72,41.66 MICROCONTROLLER1:U2.26
  Bottom 0.203: v103.78,47.5 101.85,49.43 96.73,49.43 BREAKOUT1:B1.A4 94.28,54.27 107.24,54.27 108.41,55.44
SSN  (via drill 0.35)  (1 unrouted)
  Top 0.203: v123.85,38.76 124.69,39.6 125.94,39.6 126.31,39.97 126.31,44.05 124.71,45.65 MICROCONTROLLER1:U2.36
TST  (2 unrouted)
TX0  (via drill 0.35)
  Top 0.203: MICROCONTROLLER1:U2.47 125.45,51.15 v126.36,52.07 | v87.63,44.45 85.57,44.45 BREAKOUT1:B1.1 81.81,39.29 80.72,38.2 80.72,31.34 81.23,30.84 92.21,30.84 93.76,32.38 PROGRAMMING1:JP9.RXI
  Bottom 0.203: v126.36,52.07 125.09,50.8 117.47,50.8 110.49,43.82 96.52,43.82 95.89,44.45 v87.63,44.45
TX1  (via drill 0.35)  (1 unrouted)
  Top 0.203: MICROCONTROLLER1:U2.28 120.72,41.38 v121.26,40.84
  Bottom 0.203: v121.26,40.84 121.26,36.17 BREAKOUT1:JP1.2
VCC  (via drill 0.35)  (1 unrouted)
  Top 0.203: POWER1:S2.1 142.61,45.43 139.45,42.27 v132.18,42.27
  Bottom 0.203: BICYCLE_MODULE1:D1.C 140.34,51.55 POWER1:C13.1 138.85,55.24 POWER1:C14.A 137.29,54.18 BICYCLE_MODULE1:LS1.+ 134.62,46.63 133.4,45.41 133.4,43.48 v132.18,42.27 | POWER1:U3.3 141.02,42.75 v141.02,43.84